# Altium project Controller.PrjPcb
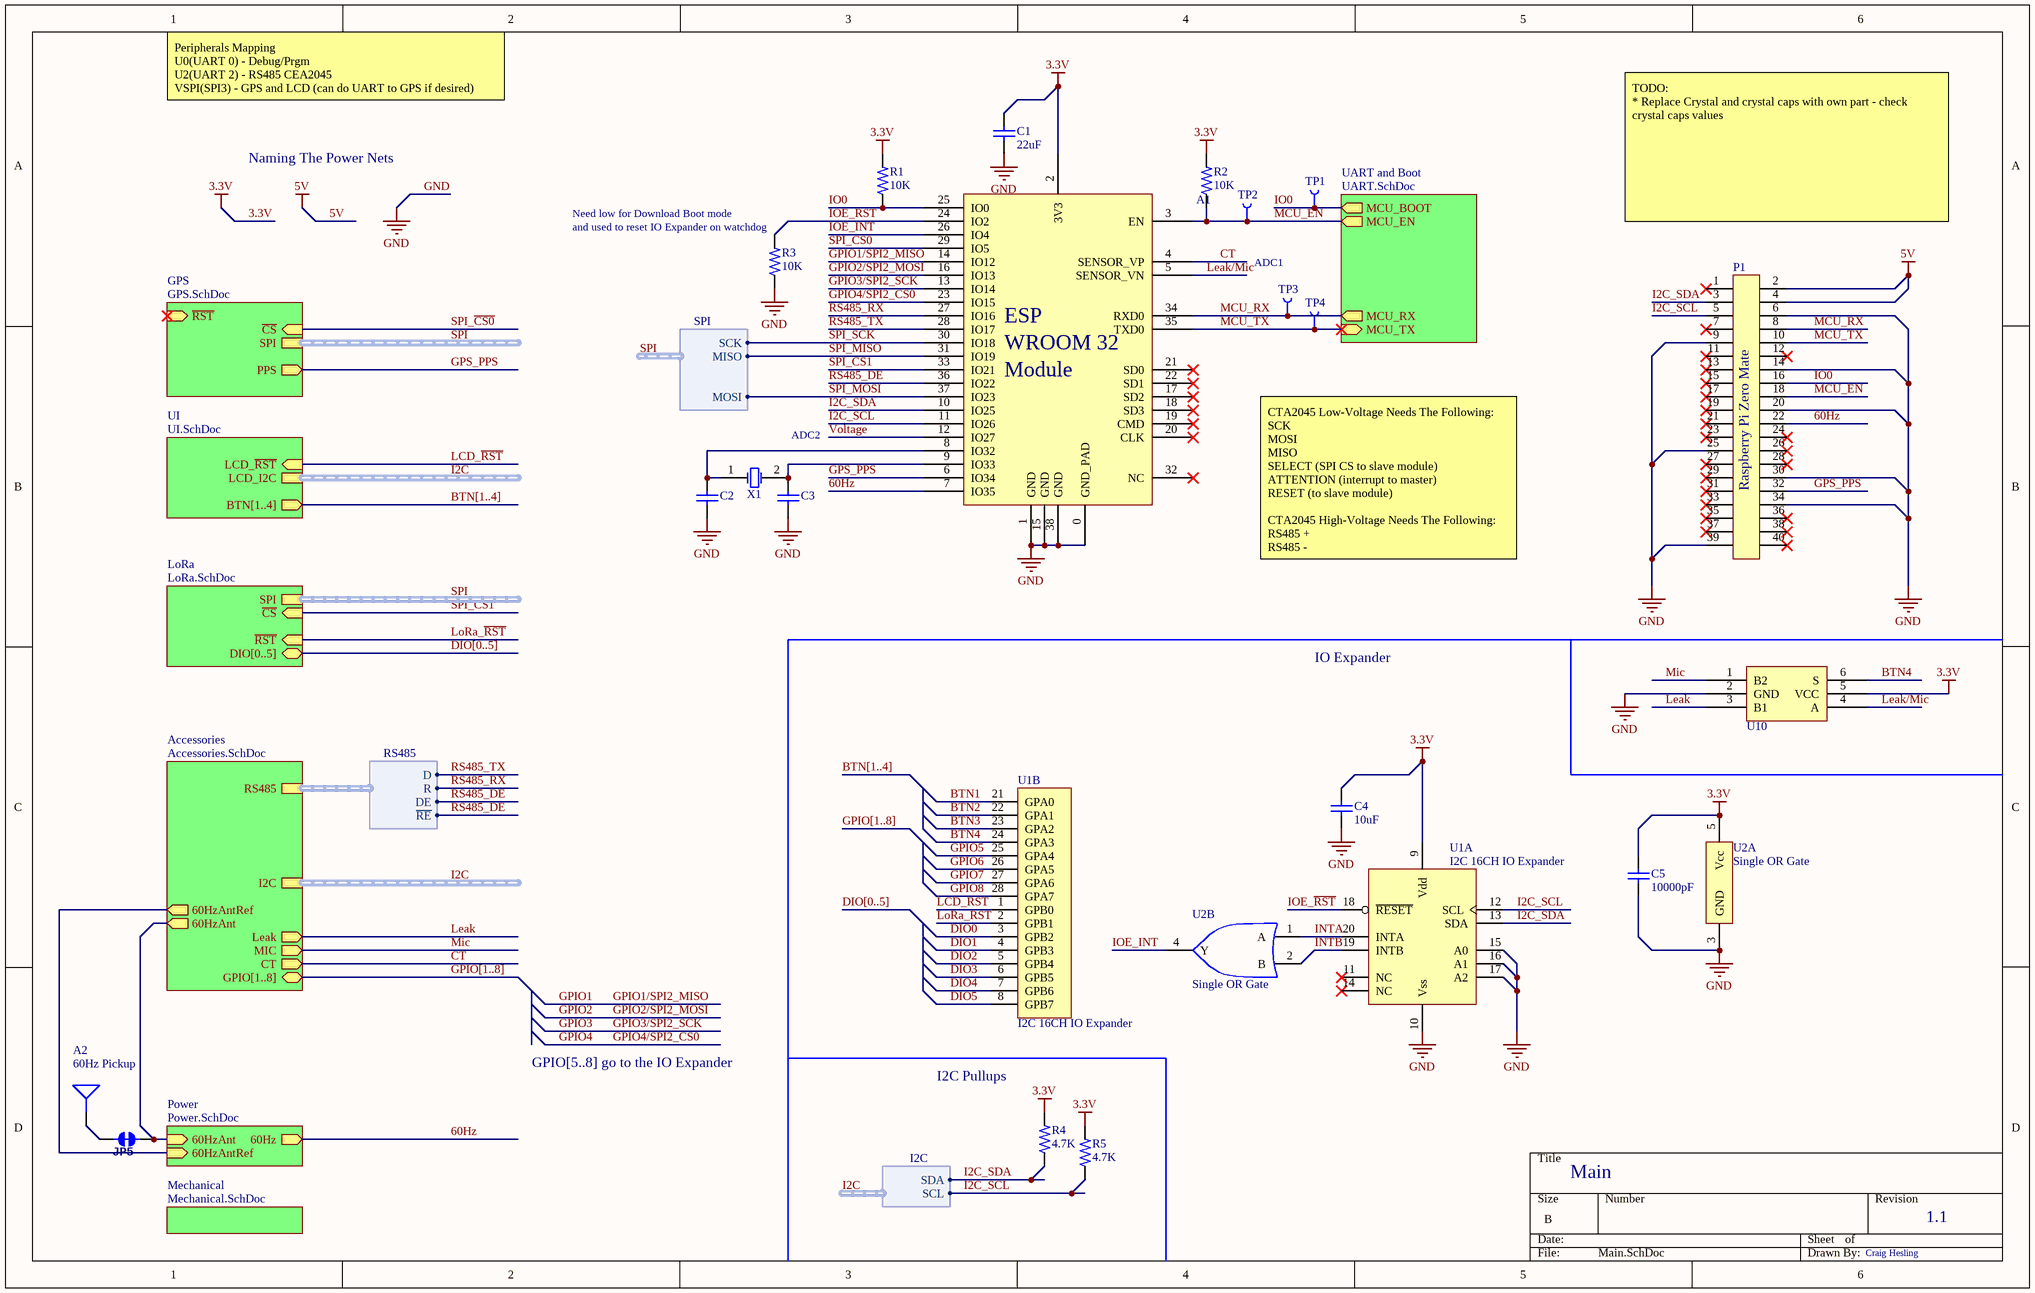
[diagram p0: Main.SchDoc]
8 sheets, 137 parts. Net scope: hierarchical (ports join the sheet entries above them; power ports are global).
Board files: PCBv1.PcbDoc, PCBv1.1.PcbDoc, PCBv1.2.PcbDoc, PCBv1.3.PcbDoc
Sheets:
  Main.SchDoc
    GPS = GPS.SchDoc
    UART and Boot = UART.SchDoc
    Power = Power.SchDoc
    Accessories = Accessories.SchDoc
    UI = UI.SchDoc
    LoRa = LoRa.SchDoc
    Mechanical = Mechanical.SchDoc

## Sheet Main.SchDoc: Main
size B; Author: Craig Hesling; DrawnBy: Craig Hesling; Revision: 1.1; SheetNumber: 1; SheetTotal: 7

### Parts
A1  ESP-WROOM-32  [ESP-WROOM-32]  (value not drawn)
A2  60Hz Pickup  [60HzPickup]
C1  22uF  [CAPC2013X14L - CAP0805 1.45mm Tall]
C2  CAP 12pF 16V 0603(1608)  [CAPC0603(1608)100_M]  (value not drawn)
C3  CAP 12pF 16V 0603(1608)  [CAPC0603(1608)100_M]  (value not drawn)
C4  10uF  [CAPC2013X14L - CAP0805 1.45mm Tall]
C5  10000pF  [CAPC1608X09L - CAP0603]
JP5  JUMPER-PAD-2-NC_BY_TRACENO_SILK  [PAD-JUMPER-2-NC_BY_TRACE_NO_SILK]  (value not drawn)
P1  Raspbery Pi Zero Mate  [Raspberry Pi Zero]  (value not drawn)
R1  10K  [RESC1608X06L - RES0603]
R2  10K  [RESC1608X06L - RES0603]
R3  10K  [RESC1608X06L - RES0603]
R4  4.7K  [RESC1608X06L - RES0603]
R5  4.7K  [RESC1608X06L - RES0603]
TP1  Test Point  [TestPoint1]  (value not drawn)
TP2  Test Point  [TestPoint1]  (value not drawn)
TP3  Test Point  [TestPoint1]  (value not drawn)
TP4  Test Point  [TestPoint1]  (value not drawn)
U1  I2C 16CH IO Expander  [SOIC127P1030X265-28L]  (parts A,B of 2)
U2  Single OR Gate  [SOT95P280X140-5L]  (parts A,B of 2)
U10  SN74LVC1G3157DCKR  [SC-70-6  (SOT-363)]  (value not drawn)
X1  14340272-32.768KHz  [ITTI-14340272-32.768KHz-2_V]  (value not drawn)

### Sub-sheets
Accessories = Accessories.SchDoc: Leak (out), MIC (out), CT (out), I2C (harness I2C), GPIO[1..8] (bidir), RS485 (harness RS485), 60HzAnt (out), 60HzAntRef (out)
GPS = GPS.SchDoc: SPI (harness SPI), ~{CS} (in), PPS (out), ~{RST} (in)
LoRa = LoRa.SchDoc: DIO[0..5] (bidir), SPI (harness SPI), ~{CS} (in), ~{RST} (in)
Mechanical = Mechanical.SchDoc: no entries
Power = Power.SchDoc: 60Hz (out), 60HzAnt (in), 60HzAntRef (in)
UART and Boot = UART.SchDoc: MCU_EN (out), MCU_BOOT (out), MCU_RX (out), MCU_TX (in)
UI = UI.SchDoc: BTN[1..4] (out), LCD_~{RST} (in), LCD_I2C (harness I2C)

### Harnesses
SPI: MISO, MOSI, SCK
RS485: R, ~{RE}, DE, D
I2C: SDA, SCL

### Nets
3.3V: A1.2(3V3) C1.2 C4.2 C5.2 R1.2 R2.2 R4.2 R5.2 U1.9(Vdd) U2.5(Vcc) U10.5(VCC)
5V: P1.2 P1.4
GND: A1.0(GND_PAD) A1.1(GND) A1.15(GND) A1.38(GND) C1.1 C2.1 C3.1 C4.1 C5.1 P1.6 P1.9 P1.14 P1.20 P1.25 P1.30 P1.34 P1.39 R3.1 U1.10(Vss) U1.15(A0) U1.16(A1) U1.17(A2) U2.3(GND) U10.2(GND)
60Hz: A1.7(IO35) P1.22 ; sheet Power/60Hz
60HzAnt: JP5.2 ; sheet Power/60HzAnt, sheet Accessories/60HzAnt
60HzAntRef: sheet Power/60HzAntRef, sheet Accessories/60HzAntRef
BTN1: U1.21(GPA0)
BTN2: U1.22(GPA1)
BTN3: U1.23(GPA2)
BTN4: U1.24(GPA3) U10.6(S)
CT: A1.4(SENSOR_VP) ; sheet Accessories/CT
DIO0: U1.3(GPB2)
DIO1: U1.4(GPB3)
DIO2: U1.5(GPB4)
DIO3: U1.6(GPB5)
DIO4: U1.7(GPB6)
DIO5: U1.8(GPB7)
GPIO1: A1.14(IO12)  [also labelled GPIO1/SPI2_MISO]
GPIO2: A1.16(IO13)  [also labelled GPIO2/SPI2_MOSI]
GPIO3: A1.13(IO14)  [also labelled GPIO3/SPI2_SCK]
GPIO4: A1.23(IO15)  [also labelled GPIO4/SPI2_~{CS0}]
GPIO5: U1.25(GPA4)
GPIO6: U1.26(GPA5)
GPIO7: U1.27(GPA6)
GPIO8: U1.28(GPA7)
GPS_PPS: A1.6(IO34) P1.32 ; sheet GPS/PPS
I2C_SCL: A1.11(IO26) P1.5 R5.1 U1.12(SCL) ; sheet Accessories/I2C.SCL  [project net I2C.SCL]
I2C_SDA: A1.10(IO25) P1.3 R4.1 U1.13(SDA) ; sheet Accessories/I2C.SDA  [project net I2C.SDA]
INTA: U1.20(INTA) U2.1(A)
INTB: U1.19(INTB) U2.2(B)
IO0: A1.25(IO0) P1.16 R1.1 TP1.1(P1) ; sheet UART and Boot/MCU_BOOT
IOE_INT: A1.26(IO4) U2.4(Y)
IOE_~{RST}: A1.24(IO2) R3.2 U1.18(~{RESET})
LCD_~{RST}: U1.1(GPB0) ; sheet UI/LCD_~{RST}
Leak: U10.3(B1) ; sheet Accessories/Leak
Leak/Mic: A1.5(SENSOR_VN) U10.4(A)
LoRa_~{RST}: U1.2(GPB1) ; sheet LoRa/~{RST}
MCU_EN: A1.3(EN) P1.18 R2.1 TP2.1(P1) ; sheet UART and Boot/MCU_EN
MCU_RX: A1.34(RXD0) P1.8 TP3.1(P1) ; sheet UART and Boot/MCU_RX
MCU_TX: A1.35(TXD0) P1.10 TP4.1(P1) ; sheet UART and Boot/MCU_TX
Mic: U10.1(B2) ; sheet Accessories/MIC
RS485_DE: A1.36(IO22) ; sheet Accessories/RS485.~{RE}, sheet Accessories/RS485.DE  [project net RS485.DE]
RS485_RX: A1.27(IO16) ; sheet Accessories/RS485.R  [project net RS485.R]
RS485_TX: A1.28(IO17) ; sheet Accessories/RS485.D  [project net RS485.D]
SPI_~{CS0}: A1.29(IO5) ; sheet GPS/~{CS}
SPI_~{CS1}: A1.33(IO21) ; sheet LoRa/~{CS}
SPI_MISO: A1.31(IO19) ; sheet GPS/SPI.MISO  [project net SPI.MISO]
SPI_MOSI: A1.37(IO23) ; sheet GPS/SPI.MOSI  [project net SPI.MOSI]
SPI_SCK: A1.30(IO18) ; sheet GPS/SPI.SCK  [project net SPI.SCK]
Voltage: A1.12(IO27)
NetA1_8: A1.8(IO32) C2.2 X1.1(X1)
NetA1_9: A1.9(IO33) C3.2 X1.2(X2)
NetA2_1: A2.1(Ant) JP5.1

Not connected (* = marked no-connect by the designer): A1 17(SD2)* 18(SD3)* 19(CMD)* 20(CLK)* 21(SD0)* 22(SD1)* 32(NC)*; P1 1* 7* 11* 12* 13* 15* 17* 19* 21* 23* 24* 26* 27* 28* 29* 31* 33* 35* 36* 37* 38* 40*; U1 11(NC)* 14(NC)*

### Buses and harness runs
bus BTN[1..4]
bus BTN[1..4] = sheet UI/BTN[1..4]
bus DIO[0..5]
bus DIO[0..5] = sheet LoRa/DIO[0..5]
bus GPIO[1..8]
bus GPIO[1..8] = sheet Accessories/GPIO[1..8]
harness I2C = sheet Accessories/I2C
harness I2C = sheet UI/LCD_I2C
harness SPI = sheet GPS/SPI
harness SPI = sheet LoRa/SPI

### Notes on the sheet
- Peripherals Mapping
  U0(UART 0) - Debug/Prgm
  U2(UART 2) - RS485 CEA2045
  VSPI(SPI3) - GPS and LCD (can do UART to GPS if desired)
  HSPI/HS2(Host SD 2) - SD Card
- Naming The Power Nets
- (near R3) Need low for Download Boot mode
- (near R3) and used to reset IO Expander on watchdog
- TODO:
  * Replace Crystal and crystal caps with own part - check crystal caps values
- ADC1
- ADC2
- CTA2045 Low-Voltage Needs The Following:
  SCK
  MOSI
  MISO
  SELECT (SPI CS to slave module)
  ATTENTION (interrupt to master)
  RESET (to slave module)
  CTA2045 High-Voltage Needs The Following:
  RS485 +
  RS485 -
- IO Expander
- GPIO[5..8] go to the IO Expander
- I2C Pullups
- (in symbol ESP-WROOM-32) ESP; WROOM 32; Module

### Library data of the parts
A1 = ESP-WROOM-32: ESP WROOM 32 Module; Supplier 1: Digi-Key; Supplier Part Number 1: 1528-1801-ND
A2 = 60Hz pickup with via: 5cm 60Hz pickup antenna with via for external wire
C1 = CAP0805 22uF 10% 6.3V X5R: SMT 0805 Ceramic Capacitor; TempCoeff: X5R; Tolerance: 10%; Voltage: 6.3V; Value: 22uF; Supplier 1: Digi-Key; Supplier Part Number 1: 1276-6687-1-ND; Supplier 2: Digi-Key; Supplier Part Number 2: 311-1860-1-ND
C2 C3 = CMP-1035-00607-1: CAP 12pF 16V ±10% 0603 (1608 Metric) Thickness 1mm SMD; Case-Metric: 1608; Tolerance: Â±10%; Case-EIA: 0603; Value: 12pF; Max Thickness: 1 mm; Technology: SMT; Rated Voltage: 16 V
C4 = CAP0805 10uF 10% 6.3V X5R: SMT 0805 Ceramic Capacitor; TempCoeff: X5R; Tolerance: 10%; Voltage: 6.3V; Value: 10uF; Supplier 1: Digi-Key; Supplier Part Number 1: 1276-6457-1-ND
C5 = CAP0603 10000pF 10% 50V X7R: SMT 0603 Ceramic Capacitor; TempCoeff: X7R; Tolerance: 10%; Voltage: 50V; Value: 10000pF; Supplier 1: Digi-Key; Supplier 2: Digi-Key; Supplier 3: Digi-Key; Supplier Part Number 1: 478-1215-1-ND; Supplier Part Number 2: 311-1080-1-ND; Supplier Part Number 3: 490-1494-1-ND
P1 = Raspberry Pi Zero Mate: The header and mechanical drawings for connnecting a Raspbery Pi Zero
R1-R3 = RES0603 10K 1% 1/10W: SMT 0603 Ceramic Resistor; Power: 1/10W; Tolerance: 1%; Supplier 1: Digi-Key; Supplier 2: Digi-Key; Supplier 3: Digi-Key; Supplier Part Number 1: 311-10.0KHRCT-ND; Supplier Part Number 2: RMCF0603FT10K0CT-ND; Supplier Part Number 3: P10.0KHCT-ND; Value: 10K
R4 R5 = RES0603 4.7K 1% 1/10W: SMT 0603 Ceramic Resistor; Power: 1/10W; Tolerance: 1%; Value: 4.7K; Supplier 1: Digi-Key; Supplier 2: Digi-Key; Supplier 3: Digi-Key; Supplier Part Number 1: 311-4.70KHRCT-ND; Supplier Part Number 2: P4.70KHCT-ND; Supplier Part Number 3: RMCF0603FT4K70CT-ND
TP1-TP4 = TestPoint1: Small 0.762mm Round Test Point
U1 = MCP23017T-E/SO: Microchip MCP23017 I2C 16CH IO Expander; Supplier 1: Digi-Key; Supplier Part Number 1: MCP23017T-E/SOCT-ND
U2 = NC7S32M5X: Fairchild/ON Semi NC7S32M5X Single OR Gate; Supplier 1: Digi-Key; Supplier Part Number 1: NC7S32M5XCT-ND
U10 = SN74LVC1G3157DCKR: IC, SWITCH, SPDT ANA, SMD; Manufacturer: Texas Instruments; Min Supply Voltage: 1.65V; Max Supply Voltage: 5.5V; Number of Channels: 1; Bandwidth: 300MHz; Number of Outputs: 2; Nominal Supply Current: 10uA; On-State Resistance: 15R; Operating Supply Current: 1uA; Turn-On Delay Time: 5.7ns; Turn-Off Delay Time: 3.8ns; Supply Type: Single; Propagation Delay: 300ps; Polarity: Non-Inverting; Low Level Output Current: 128mA; Supplier 1: Avnet; Manufacturer Part Number: SN74LVC1G3157DCKR; Stock 1: 76000; Pricing 1: 1=0.29612, 30=0.2755, 75=0.21727, 150=0.1881, 375=0.15656, 3000=0.07742, 6000=0.07106, 12000=0.07058, 18000=0.07011, 30000=0.05947 (USD); Mount: Surface Mount; Case/Package: SC; Number of Pins: 6; Weight: 8.8E-05oz; Contact Plating: Gold; Min Operating Temperature: -40°C; Max Operating Temperature: 125°C; Packaging: Tape and Reel; Number of Inputs: 1; Package Quantity: 3000; Max Supply Current: 10uA; Termination: SMD/SMT; Throw Configuration: SPDT; Number of Bits: 1; High Level Output Current: 128mA; Length: 2mm; Height: 0.9mm; Width: 1.25mm; Radiation Hardening: No; REACH SVHC: No SVHC; Lead Free: Lead Free; ComponentLink1URL: https://datasheet.ciiva.com/1669/sn74lvc1g3157-1669380.pdf; ComponentLink1Description: https://datasheet.ciiva.com/1669/sn74lvc1g3157-1669380.pdf; ComponentLink2URL: https://datasheet.ciiva.com/1514/1857156-1514549.pdf; ComponentLink2Description: https://datasheet.ciiva.com/1514/1857156-1514549.pdf; ComponentLink3URL: https://datasheet.ciiva.com/1669/sn74lvc1g3157-1669381.pdf; ComponentLink3Description: https://datasheet.ciiva.com/1669/sn74lvc1g3157-1669381.pdf; ComponentLink4URL: https://datasheet.ciiva.com/14435/sn74lvc1g3157-14435733.pdf; ComponentLink4Description: https://datasheet.ciiva.com/14435/sn74lvc1g3157-14435733.pdf; ComponentLink5URL: https://datasheet.ciiva.com/34301/756764-34301477.pdf; ComponentLink5Description: https://datasheet.ciiva.com/34301/756764-34301477.pdf; ComponentLink6URL: https://datasheet.ciiva.com/1514/1857156-1514550.pdf; ComponentLink6Description: https://datasheet.ciiva.com/1514/1857156-1514550.pdf; ComponentLink7URL: https://datasheet.ciiva.com/1669/sn74lvc1g3157-1669382.pdf; ComponentLink7Description: https://datasheet.ciiva.com/1669/sn74lvc1g3157-1669382.pdf; ComponentLink8URL: https://datasheet.ciiva.com/46411/1786793-46411528.pdf; ComponentLink8Description: https://datasheet.ciiva.com/46411/1786793-46411528.pdf; ComponentLink9URL: https://datasheet.ciiva.com/16539/sn74lvc1g3157-16539371.pdf; ComponentLink9Description: https://datasheet.ciiva.com/16539/sn74lvc1g3157-16539371.pdf; ComponentLink10URL: https://datasheet.ciiva.com/15127/getdatasheetpartid-187022-15127388.pdf; ComponentLink10Description: https://datasheet.ciiva.com/15127/getdatasheetpartid-187022-15127388.pdf; ComponentLink11URL: https://datasheet.ciiva.com/41461/001187224-da-01-en-ic-switch-sn74lvc1g3157dckr-sc-70-6-tid-41461882.pdf; ComponentLink11Description: https://datasheet.ciiva.com/41461/001187224-da-01-en-ic-switch-sn74lvc1g3157dckr-sc-70-6-tid-41461882.pdf; Supplier Part Number 1: SN74LVC1G3157DCKR/BKN
X1 = CMP-0463-00001-2: Crystal, 32.768 KHz, -40 to 85 degC, 3.2 x 1.5 x 0.9 mm SMD; Manufacturer: ITTI; Load Capacitance: 12.5 pF; Frequency Tolerance: +/-20 ppm; Drive Level: 1 max. uw; Nominal Frequency: 32.768KHz; Mounting Technology: Surface Mount; Operating temperature: -40 to 85 degC; PartNumber: 14340272-32.768KHz; ComponentLink1URL: http://www.itti-co.com; ComponentLink1Description: Manufacturer URL; PackageReference: 14340272-32.768KHz-2; PackageDescription: 2-Pin Hand Drawn, Body 3.2 x 1.5mm, Pitch 2.5 mm

## Sheet GPS.SchDoc: GPS
size A; Author: Craig Hesling; DrawnBy: Craig Hesling; Revision: 1
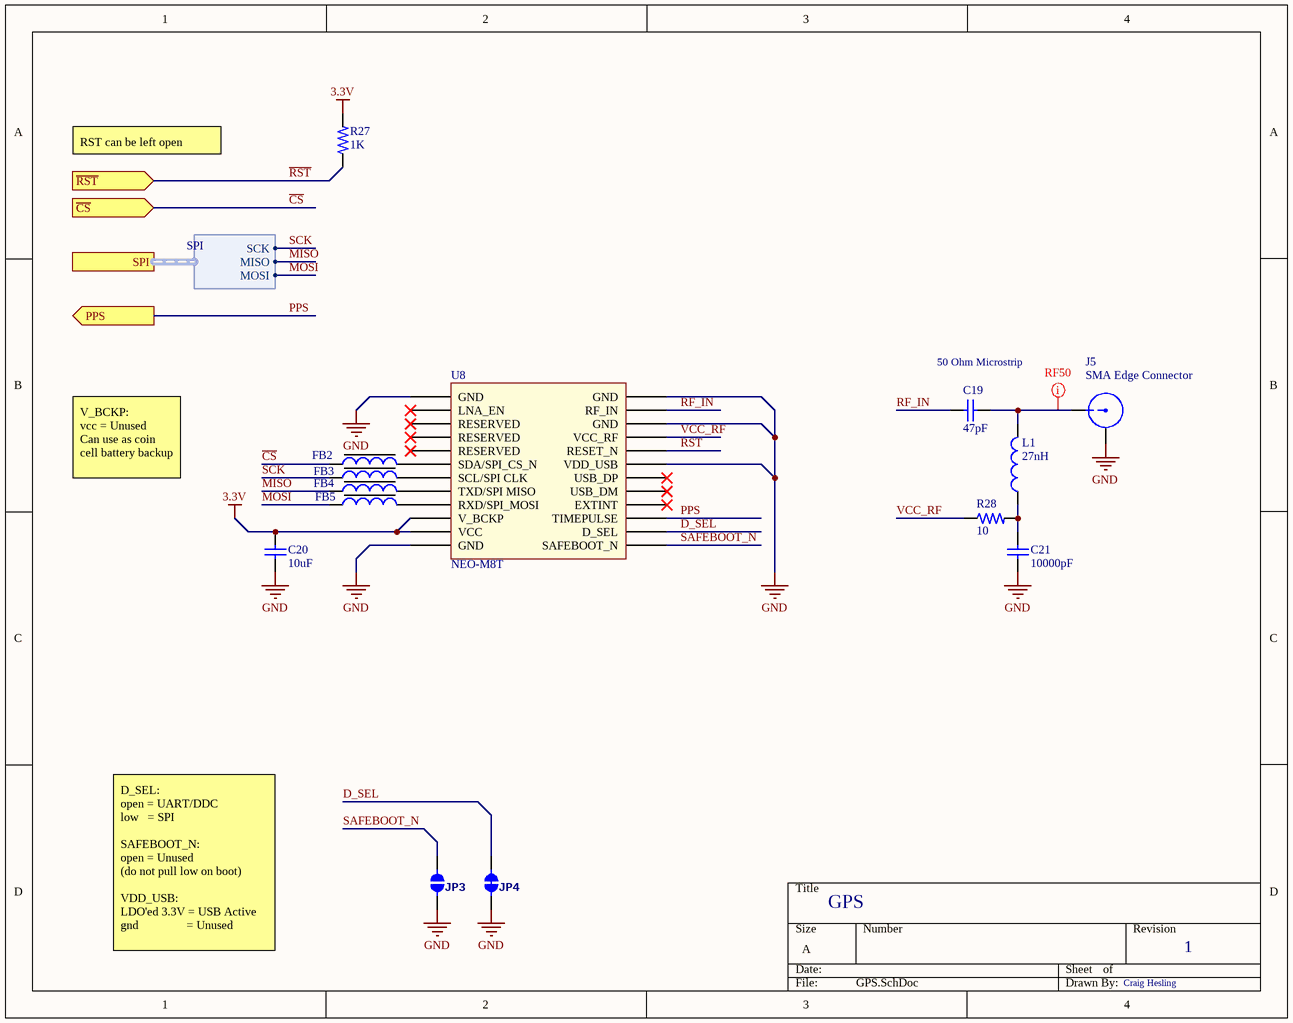
[diagram p1: GPS.SchDoc]

### Parts
C19  47pF  [CAPC1608X09L - CAP0603]
C20  10uF  [CAPC2013X14L - CAP0805 1.45mm Tall]
C21  10000pF  [CAPC1608X09L - CAP0603]
FB2  Feritte Bead 1kOhm  [FB1608X09L]  (value not drawn)
FB3  Feritte Bead 1kOhm  [FB1608X09L]  (value not drawn)
FB4  Feritte Bead 1kOhm  [FB1608X09L]  (value not drawn)
FB5  Feritte Bead 1kOhm  [FB1608X09L]  (value not drawn)
J5  SMA Edge Connector  [SMA Connector - Edge Mount Short]
JP3  JUMPER-PAD-2-NO  [PAD-JUMPER-2-NO_NO_SILK]  (value not drawn)
JP4  JUMPER-PAD-2-NC_BY_TRACENO_SILK  [PAD-JUMPER-2-NC_BY_TRACE_NO_SILK]  (value not drawn)
L1  27nH  [INDC1608X09L - IND0603 0.95MM TALL]
R27  1K  [RESC1608X06L - RES0603]
R28  10  [RESC1608X06L - RES0603]
U8  NEO-M8T  [NEO]

### Ports
PPS (out), SPI (harness SPI), ~{CS} (in), ~{RST} (in)

### Harnesses
SPI: MISO, MOSI, SCK

### Nets
3.3V: C20.2 R27.2 U8.22(V_BCKP) U8.23(VCC)
GND: C20.1 C21.1 J5.2(GND) JP3.1 JP4.1 U8.7(VDD_USB) U8.10(GND) U8.12(GND) U8.13(GND) U8.24(GND)
~{CS}: FB2.1 ; port ~{CS}  [project net SPI_~{CS0}]
D_SEL: JP4.2 U8.2(D_SEL)
MISO: FB4.1 ; port SPI.MISO  [project net SPI.MISO]
MOSI: FB5.1 ; port SPI.MOSI  [project net SPI.MOSI]
PPS: U8.3(TIMEPULSE) ; port PPS  [project net GPS_PPS]
~{RST}: R27.1 U8.8(RESET_N) ; port ~{RST}
RF_IN: C19.1 U8.11(RF_IN)
SAFEBOOT_N: JP3.2 U8.1(SAFEBOOT_N)
SCK: FB3.1 ; port SPI.SCK  [project net SPI.SCK]
VCC_RF: R28.1 U8.9(VCC_RF)
NetC19_2: C19.2 J5.1(Signal) L1.2
NetC21_2: C21.2 L1.1 R28.2
NetFB2_2: FB2.2 U8.18(SDA/SPI_CS_N)
NetFB3_2: FB3.2 U8.19(SCL/SPI_CLK)
NetFB4_2: FB4.2 U8.20(TXD/SPI_MISO)
NetFB5_2: FB5.2 U8.21(RXD/SPI_MOSI)

Not connected (* = marked no-connect by the designer): U8 4(EXTINT)* 5(USB_DM)* 6(USB_DP)* 14(LNA_EN)* 15(RESERVED)* 16(RESERVED)* 17(RESERVED)*

### Layout directives
net class RF50: NetC19_2

### Notes on the sheet
- RST can be left open
- (near C19) 50 Ohm Microstrip
- V_BCKP:
  vcc = Unused
  Can use as coin cell battery backup
- D_SEL:
  open = UART/DDC
  low   = SPI
  SAFEBOOT_N:
  open = Unused
  (do not pull low on boot)
  VDD_USB:
  LDO'ed 3.3V = USB Active
  gnd                = Unused

### Library data of the parts
C19 = CAP0603 47pF 5% 50V NP0: SMT 0603 Ceramic Capacitor; TempCoeff: NP0; Tolerance: 5%; Voltage: 50V; Value: 47pF; Supplier 1: Digi-Key; Supplier 2: Digi-Key; Supplier 3: Arrow; Supplier 4: Digi-Key; Supplier Part Number 1: 1276-1037-1-ND; Supplier Part Number 2: 1276-2296-1-ND; Supplier Part Number 3: CFabNzdY6X6BB7Ej2OVMNUmEE8oTDHVGVspzp79aHa0; Supplier Part Number 4: 399-1056-1-ND
C20 = CAP0805 10uF 10% 6.3V X5R: as C4 on sheet Main; Value: 10uF; Supplier 1: Digi-Key; Supplier Part Number 1: 1276-6457-1-ND
C21 = CAP0603 10000pF 10% 50V X7R: as C5 on sheet Main; Value: 10000pF; Supplier 1: Digi-Key; Supplier 2: Digi-Key; Supplier 3: Digi-Key; Supplier Part Number 1: 478-1215-1-ND; Supplier Part Number 2: 311-1080-1-ND; Supplier Part Number 3: 490-1494-1-ND
FB2-FB5 = FB0603 1kOhm: Impedance at 100MHz: 1kOhms; Supplier 1: Digi-Key; Supplier Part Number 1: 490-1015-1-ND
L1 = IND0603 27nH 400mA 5% 650mOhm 1.7GHz: SMT 0603 Ceramic Inductor; Tolerance: 5%; Current Rating: 300mA; DC Resistance: 450mOhm; Self Resonant: 1.7GHz; Value: 27nH; Supplier 1: Digi-Key; Supplier Part Number 1: 732-6268-1-ND
R27 = RES0603 1K 1% 1/10W: SMT 0603 Ceramic Resistor; Power: 1/10W; Tolerance: 1%; Value: 1K; Supplier 1: Digi-Key; Supplier 2: Digi-Key; Supplier 3: Digi-Key; Supplier Part Number 1: 311-1.00KHRCT-ND; Supplier Part Number 2: P1.00KHCT-ND; Supplier Part Number 3: RMCF0603FG1K00CT-ND
R28 = RES0603 10 1% 1/10W: SMT 0603 Ceramic Resistor; Power: 1/10W; Tolerance: 1%; Value: 10; Supplier 1: Digi-Key; Supplier 2: Digi-Key; Supplier 3: Digi-Key; Supplier Part Number 1: 311-10.0HRCT-ND; Supplier Part Number 2: RMCF0603FT10R0CT-ND; Supplier Part Number 3: CR0603-FX-10R0ELFCT-ND
U8 = NEO: u-blox NEO GNSS module; Part Description: u-blox GNSS module; Value: NEO-M8; Manufacturer: u-blox
J5 = SMA Edge Connector: Supplier 1: Digi-Key; Supplier 2: Digi-Key; Supplier 3: Digi-Key; Supplier Part Number 1: CON-SMA-EDGE-S-ND; Supplier Part Number 2: 931-1174-ND; Supplier Part Number 3: 931-1175-ND

## Sheet UART.SchDoc: UART
size A; DrawnBy: Craig Hesling; Revision: 2
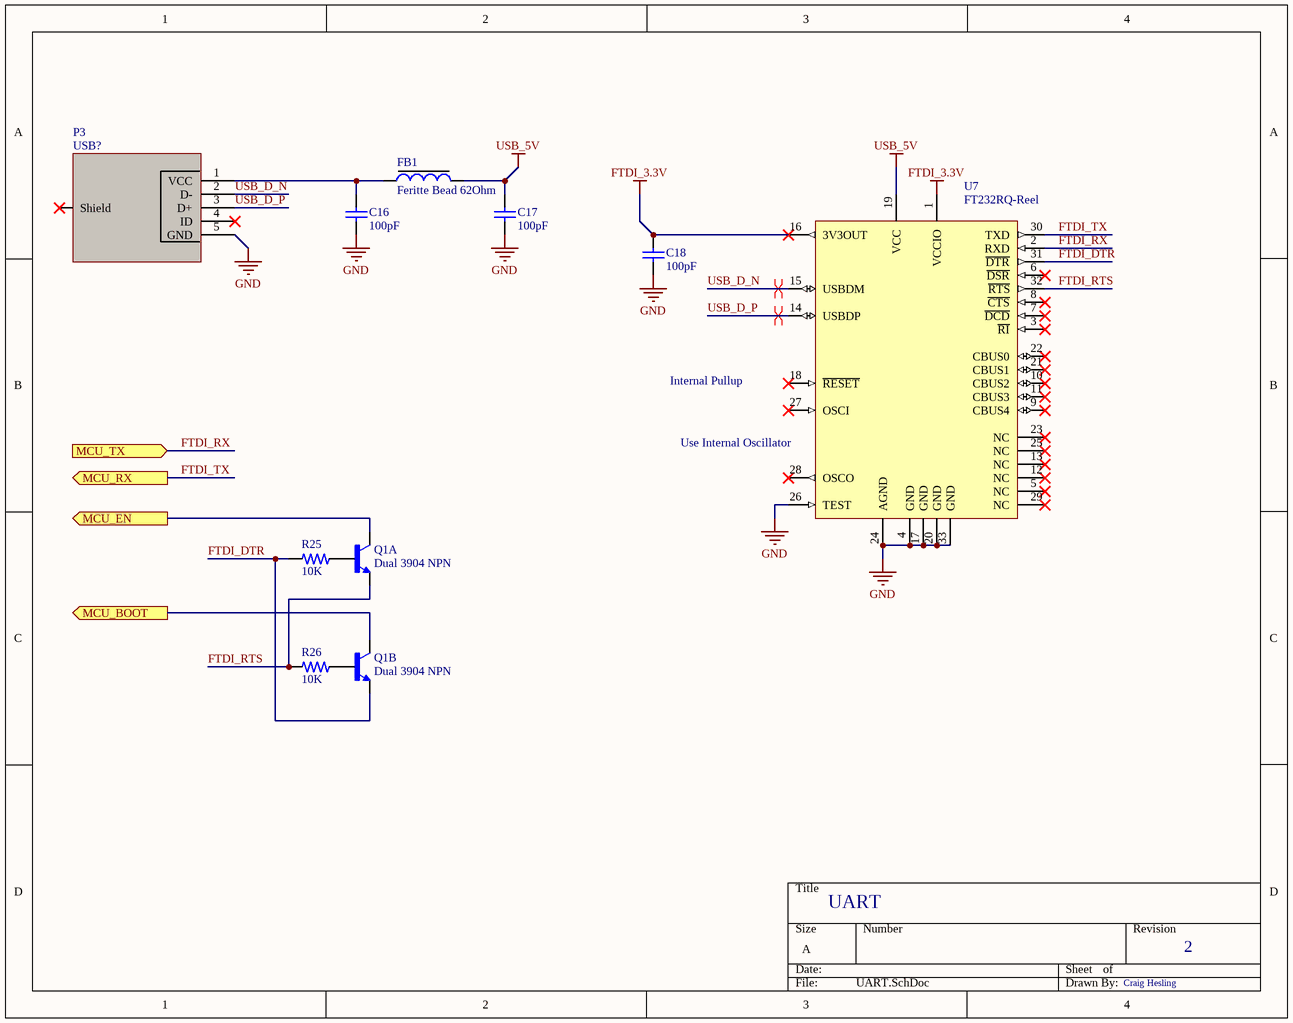
[diagram p2: UART.SchDoc]

### Parts
C16  100pF  [CAPC1608X09L - CAP0603]
C17  100pF  [CAPC1608X09L - CAP0603]
C18  100pF  [CAPC1608X09L - CAP0603]
FB1  Feritte Bead 62Ohm  [INDC1608X10L - FL0603]
P3  USB?  [MicroUSB_TypeB]
Q1  Dual 3904 NPN  [SOT65P210X110-6L]  (parts A,B of 2)
R25  10K  [RESC1608X06L - RES0603]
R26  10K  [RESC1608X06L - RES0603]
U7  FT232RQ-Reel  [PQFN5X5-32_V_FTDI_BIG_VIAS_LEADS]

### Ports
MCU_BOOT (out), MCU_EN (out), MCU_RX (out), MCU_TX (in)

### Nets
FTDI_3.3V: C18.2 U7.1(VCCIO) U7.16(3V3OUT)
GND: C16.1 C17.1 C18.1 P3.5(GND) U7.4(GND) U7.17(GND) U7.20(GND) U7.24(AGND) U7.26(TEST) U7.33(GND)
USB_5V: C17.2 FB1.2 U7.19(VCC)
FTDI_DTR: Q1.1(E2) R25.2 U7.31(~{DTR})
FTDI_RTS: Q1.4(E1) R26.2 U7.32(~{RTS})
FTDI_RX: U7.2(RXD) ; port MCU_TX  [project net MCU_TX]
FTDI_TX: U7.30(TXD) ; port MCU_RX  [project net MCU_RX]
IO0: Q1.6(C2) ; port MCU_BOOT
MCU_EN: Q1.3(C1) ; port MCU_EN
USB_D_N: P3.2(D-) U7.15(USBDM)
USB_D_P: P3.3(D+) U7.14(USBDP)
NetC16_2: C16.2 FB1.1 P3.1(VCC)
NetQ1_2: Q1.2(B2) R26.1
NetQ1_5: Q1.5(B1) R25.1

Not connected (* = marked no-connect by the designer): P3 0(Shield)* 4(ID)*; U7 3(~{RI})* 5(NC)* 6(~{DSR})* 7(~{DCD})* 8(~{CTS})* 9(CBUS4)* 10(CBUS2)* 11(CBUS3)* 12(NC)* 13(NC)* 18(~{RESET})* 21(CBUS1)* 22(CBUS0)* 23(NC)* 25(NC)* 27(OSCI)* 28(OSCO)* 29(NC)*

### Layout directives
differential pair: USB_D_N, USB_D_P

### Notes on the sheet
- Internal Pullup
- (near U7) Use Internal Oscillator

### Library data of the parts
C16-C18 = CAP0603 100pF 5% 50V NP0: SMT 0603 Ceramic Capacitor; TempCoeff: NP0; Tolerance: 5%; Voltage: 50V; Value: 100pF; Supplier 1: Digi-Key; Supplier 2: Digi-Key; Supplier Part Number 1: 399-1061-1-ND; Supplier Part Number 2: 490-1427-1-ND
FB1 = FB0603 62Ohm: Impedance at 100MHz: 62Ohms; Supplier 1: Digi-Key; Supplier Part Number 1: 732-6702-1-ND
P3 = MicroUSB TypeB: Micro USB Type B Port; Supplier: http://www.digikey.com/product-detail/en/amphenol-fci/10118192-0001LF/609-4613-2-ND/2785387; Datasheet: http://portal.fciconnect.com/Comergent//fci/drawing/10118192.pdf; Supplier 1: Digi-Key; Supplier Part Number 1: 609-4613-1-ND
Q1 = MBT3904DW1T1G: 3904 Dual NPN Transistor; Supplier 1: Digi-Key; Supplier 2: Mouser; Supplier Part Number 1: MBT3904DW1T1GOSCT-ND; Supplier Part Number 2: 863-SMBT3904DW1T1G
R25 R26 = RES0603 10K 1% 1/10W: as R1 on sheet Main; Supplier 1: Digi-Key; Supplier 2: Digi-Key; Supplier 3: Digi-Key; Supplier Part Number 1: 311-10.0KHRCT-ND; Supplier Part Number 2: RMCF0603FT10K0CT-ND; Supplier Part Number 3: P10.0KHCT-ND; Value: 10K
U7 = FT232RQ-Reel: USB UART Asynchronous Serial Data Transfer Chip, 32-pin QFN, Tape and Reel; Manufacturer: FTDI; DatasheetVersion: ver 2.10, Mar-2012; PackageVersion: Mar-12; PackageReference: PQFN5X5-32; PackageDescription: 32-Pin Quad Flat No-Lead 0.5 mm Pitch, Pullback, 3.2 x 3.2 mm Exposed Pad; PartNumber: FT232RQ-Reel; ComponentLink1Description: Manufacturer URL; ComponentLink1URL: http://www.ftdichip.com/; ComponentLink2Description: Datasheet; ComponentLink2URL: http://www.ftdichip.com/Support/Documents/DataSheets/ICs/DS_FT232R.pdf

## Sheet Power.SchDoc: Power
size A; Author: Craig Hesling; DrawnBy: Craig Hesling; Revision: 1.1
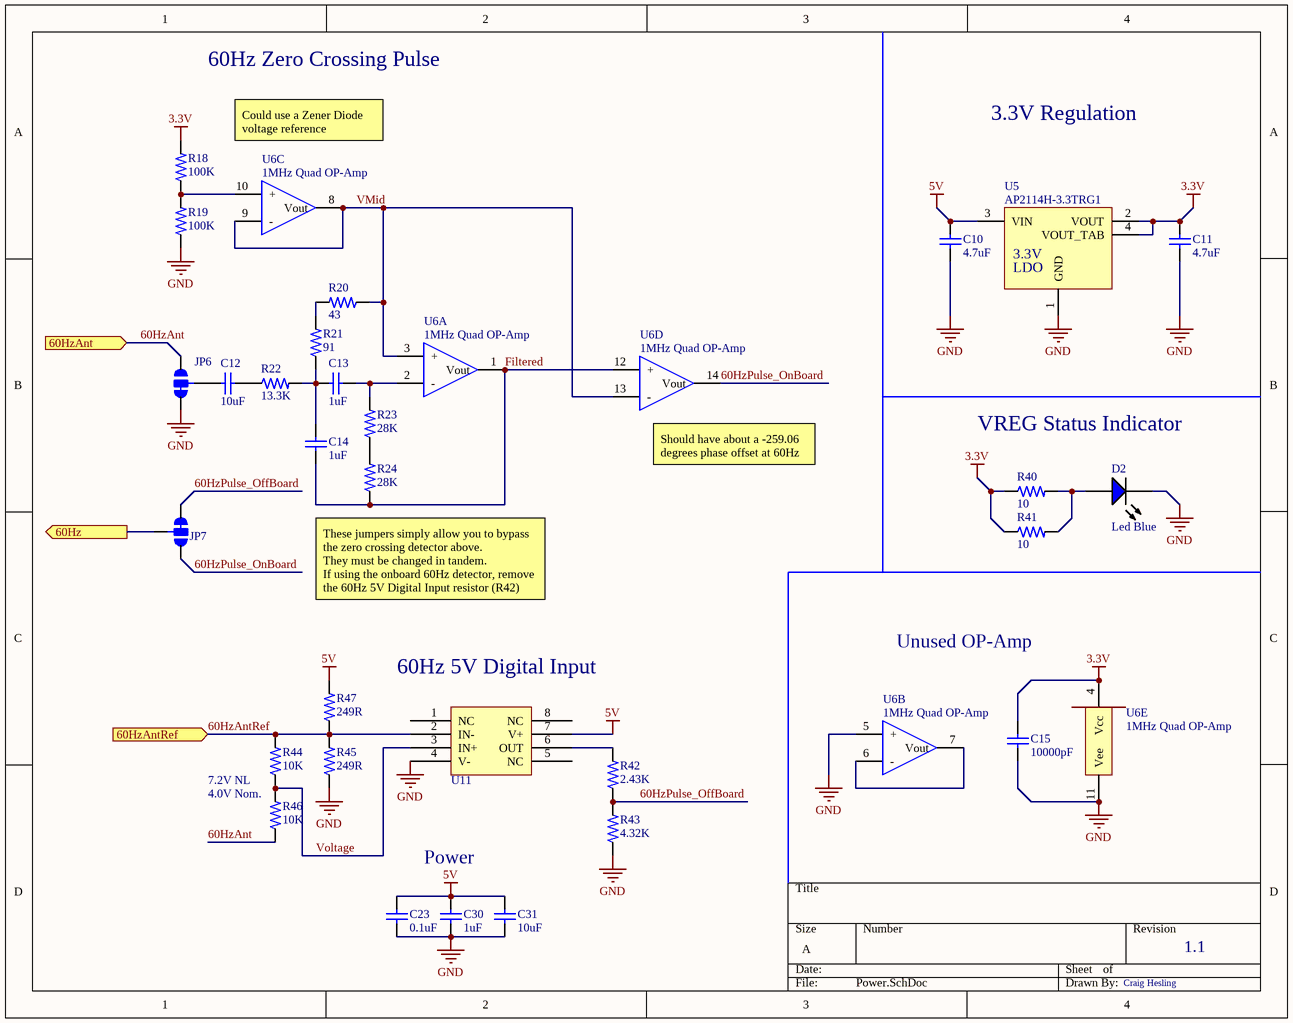
[diagram p3: Power.SchDoc]

### Parts
C10  4.7uF  [CAPC3216X18L - CAP1206 1.8MM TALL]
C11  4.7uF  [CAPC3216X18L - CAP1206 1.8MM TALL]
C12  10uF  [CAPC1608X09L - CAP0603]
C13  1uF  [CAPC1608X09L - CAP0603]
C14  1uF  [CAPC1608X09L - CAP0603]
C15  10000pF  [CAPC1608X09L - CAP0603]
C23  0.1uF  [CAPC1608X09L - CAP0603]
C30  1uF  [CAPC1608X09L - CAP0603]
C31  10uF  [CAPC1608X09L - CAP0603]
D2  Led Blue  [LED-0603-BLUE .7MM TALL]
JP6  JUMPER-PAD-3-2OF3_NC_BY_TRACE_SMALL  [PAD-JUMPER-3-2OF3_NC_BY_TRACE_YES_SILK_FULL_BOX]  (value not drawn)
JP7  JUMPER-PAD-3-2OF3_NC_BY_TRACE_SMALL  [PAD-JUMPER-3-2OF3_NC_BY_TRACE_YES_SILK_FULL_BOX]  (value not drawn)
R18  100K  [RESC1608X06L - RES0603]
R19  100K  [RESC1608X06L - RES0603]
R20  43  [RESC1608X06L - RES0603]
R21  91  [RESC1608X06L - RES0603]
R22  13.3K  [RESC1608X06L - RES0603]
R23  28K  [RESC1608X06L - RES0603]
R24  28K  [RESC1608X06L - RES0603]
R40  10  [RESC1608X06L - RES0603]
R41  10  [RESC1608X06L - RES0603]
R42  2.43K  [RESC1608X06L - RES0603]
R43  4.32K  [RESC1608X06L - RES0603]
R44  10K  [RESC1608X06L - RES0603]
R45  249R  [RESC1608X06L - RES0603]
R46  10K  [RESC1608X06L - RES0603]
R47  249R  [RESC1608X06L - RES0603]
U5  AP2114H-3.3TRG1  [SOT230P700X180-4L]
U6  1MHz Quad OP-Amp  [SOIC127P600X175-14L]  (parts A,B,C,D,E of 5)
U11  LT1818IS8#PBF  [SOIC127P600X175-8N]  (value not drawn)

### Ports
60Hz (out), 60HzAnt (in), 60HzAntRef (in)

### Nets
3.3V: C11.2 C15.2 R18.2 R40.1 R41.1 U5.2(VOUT) U5.4(VOUT_TAB) U6.4(Vcc)
5V: C10.2 C23.2 C30.2 C31.2 R47.2 U5.3(VIN) U11.7(V+)
GND: C10.1 C11.1 C15.1 C23.1 C30.1 C31.1 D2.K JP6.3 R19.1 R43.1 R45.1 U5.1(GND) U6.5(+) U6.11(Vee) U11.4(V-)
60Hz: JP7.2 ; port 60Hz
60HzAnt: JP6.1 R46.1 ; port 60HzAnt
60HzAntRef: R44.2 R45.2 R47.1 U11.2(IN-) ; port 60HzAntRef
60HzPulse_OffBoard: JP7.3 R42.1 R43.2
60HzPulse_OnBoard: JP7.1 U6.14(Vout)
Filtered: C14.1 R24.1 U6.1(Vout) U6.12(+)
VMid: R20.1 U6.3(+) U6.8(Vout) U6.9(-) U6.13(-)
Voltage: R44.1 R46.2 U11.3(IN+)
NetC12_1: C12.1 R22.1
NetC12_2: C12.2 JP6.2
NetC13_1: C13.1 R23.2 U6.2(-)
NetC13_2: C13.2 C14.2 R21.1 R22.2
NetD2_A: D2.A R40.2 R41.2
NetR18_1: R18.1 R19.2 U6.10(+)
NetR20_2: R20.2 R21.2
NetR23_1: R23.1 R24.2
NetR42_2: R42.2 U11.6(OUT)
NetU6_6: U6.6(-) U6.7(Vout)

Not connected (* = marked no-connect by the designer): U11 1(NC) 5(NC) 8(NC)

### Notes on the sheet
- 60Hz Zero Crossing Pulse
- Could use a Zener Diode voltage reference
- 3.3V Regulation
- VREG Status Indicator
- (near U6) Should have about a -259.06 degrees phase offset at 60Hz
- (near R24) These jumpers simply allow you to bypass the zero crossing detector above.
  They must be changed in tandem.
  If using the onboard 60Hz detector, remove the 60Hz 5V Digital Input resistor (R42) also.
- (near U11) 60Hz 5V Digital Input
- Unused OP-Amp
- 7.2V NL
- 4.0V Nom.
- (in symbol AP2114H-3.3TRG1) 3.3V; LDO

### Library data of the parts
C10 C11 = CAP1206 4.7uF 10% 25V X5R: SMT 1206 Ceramic Capacitor; TempCoeff: X5R; Tolerance: 10%; Voltage: 25V; Value: 4.7uF; Supplier 1: Digi-Key; Supplier Part Number 1: 587-1336-1-ND
C12 C31 = CAP0603 10uF 20% 6.3V X5R: SMT 0603 Ceramic Capacitor; TempCoeff: X5R; Tolerance: 20%; Voltage: 6.3V; Value: 10uF; Supplier 1: Digi-Key; Supplier 2: Digi-Key; Supplier Part Number 1: 587-1256-1-ND; Supplier Part Number 2: 490-3896-1-ND
C13 C14 C30 = CAP0603 1uF 10% 10V X7R: SMT 0603 Ceramic Capacitor; TempCoeff: X7R; Tolerance: 10%; Voltage: 10V; Value: 1uF; Supplier 1: Digi-Key; Supplier Part Number 1: 1276-1946-1-ND; Supplier 2: Digi-Key; Supplier Part Number 2: 399-3118-1-ND
C15 = CAP0603 10000pF 10% 50V X7R: as C5 on sheet Main; Value: 10000pF; Supplier 1: Digi-Key; Supplier 2: Digi-Key; Supplier 3: Digi-Key; Supplier Part Number 1: 478-1215-1-ND; Supplier Part Number 2: 311-1080-1-ND; Supplier Part Number 3: 490-1494-1-ND
C23 = CAP0603 0.1uF 10% 25V X7R: SMT 0603 Ceramic Capacitor; TempCoeff: X7R; Tolerance: 10%; Voltage: 25V; Value: 0.1uF; Supplier 1: Digi-Key; Supplier 2: Digi-Key; Supplier Part Number 1: 311-1341-1-ND; Supplier Part Number 2: 490-1524-1-ND
D2 = LED0603 BLUE 20mA 250mcd: LED BLUE CLEAR 0603 SMD 145 mcd; Supplier 1: Digi-Key; Supplier Part Number 1: 732-4966-6-ND
R18 R19 = RES0603 100K 1% 1/10W: SMT 0603 Ceramic Resistor; Power: 1/10W; Tolerance: 1%; Value: 100K; Supplier 1: Digi-Key; Supplier Part Number 1: 311-100KHRCT-ND
R20 = RES0603 43 1% 1/10W: SMT 0603 Ceramic Resistor; Power: 1/10W; Tolerance: 1%; Value: 43; Supplier 1: Digi-Key; Supplier Part Number 1: 311-43.0HRCT-ND; Supplier 2: Digi-Key; Supplier Part Number 2: P43.0HCT-ND
R21 = RES0603 91 1% 1/10W: SMT 0603 Ceramic Resistor; Power: 1/10W; Tolerance: 1%; Value: 91; Supplier 1: Digi-Key; Supplier 2: Digi-Key; Supplier 3: Digi-Key; Supplier Part Number 1: 311-91.0HRCT-ND; Supplier Part Number 2: 541-91.0HCT-ND; Supplier Part Number 3: RHM91CFCT-ND
R22 = RES0603 13.3K 1% 1/10W: SMT 0603 Ceramic Resistor; Power: 1/10W; Tolerance: 1%; Value: 13.3K; Supplier 1: Digi-Key; Supplier 2: Digi-Key; Supplier Part Number 1: 311-13.3KHRCT-ND; Supplier Part Number 2: P13.3KHCT-ND
R23 R24 = RES0603 28K 0.1% 1/10W: SMT 0603 Ceramic Resistor; Power: 1/10W; Tolerance: 0.1%; Value: 28K; Supplier 1: Digi-Key; Supplier 2: Digi-Key; Supplier Part Number 1: YAG4680CT-ND; Supplier Part Number 2: P28KDBCT-ND
R40 R41 = RES0603 10 1% 1/10W: as R28 on sheet GPS; Value: 10; Supplier 1: Digi-Key; Supplier 2: Digi-Key; Supplier 3: Digi-Key; Supplier Part Number 1: 311-10.0HRCT-ND; Supplier Part Number 2: RMCF0603FT10R0CT-ND; Supplier Part Number 3: CR0603-FX-10R0ELFCT-ND
R42 = RES0603 2.43K 1% 1/10W: SMT 0603 Ceramic Resistor; Power: 1/10W; Tolerance: 1%; Value: 2.43K; Supplier 1: Digi-Key; Supplier 2: Mouser; Supplier Part Number 1: 311-2.43KHRDKR-ND; Supplier Part Number 2: 603-RC0603FR-072K43L
R43 = RES0603 4.32K 1% 1/10W: SMT 0603 Ceramic Resistor; Power: 1/10W; Tolerance: 1%; Value: 4.32K; Supplier 1: Digi-Key; Supplier 2: Digi-Key; Supplier 3: Digi-Key; Supplier Part Number 1: 311-4.32KHRTR-ND; Supplier Part Number 2: P4.32KHCT-ND; Supplier Part Number 3: CRCW06034K32FKEB-ND
R44 R46 = RES0603 10K 1% 1/10W: as R1 on sheet Main; Supplier 1: Digi-Key; Supplier 2: Digi-Key; Supplier 3: Digi-Key; Supplier Part Number 1: 311-10.0KHRCT-ND; Supplier Part Number 2: RMCF0603FT10K0CT-ND; Supplier Part Number 3: P10.0KHCT-ND; Value: 10K
R45 R47 = RC0603FR-07249RL: RES SMD 249 OHM 1% 1/10W 0603; Manufacturer: Yageo; Power Rating: 100mW; Voltage Rating: 50V; Temperature Coefficient: 100ppm/°C; Supplier 1: Digi-Key; Manufacturer Part Number: RC0603FR-07249RL; Stock 1: 517619; Pricing 1: 1=0.1, 10=0.015, 100=0.006, 1000=0.00268, 2500=0.00233 (USD); Case/Package: 0603; Case Code (Imperial): 0603; Case Code (Metric): 1608; Min Operating Temperature: -55°C; Max Operating Temperature: 155°C; Resistance: 249R; Tolerance: 1%; Packaging: Tape and Reel; Package Quantity: 1; Termination: SMD/SMT; Composition: Thick Film; Number of Terminations: 2; Max Power Dissipation: 100mW; Voltage Rating (DC): 50V; Military Standard: Not; Length: 0.063inch; Height: 0.022inch; Width: 0.031inch; Depth: 0.8mm; Lead Free: Lead Free; ComponentLink1URL: https://datasheet.ciiva.com/2454/pyu-r-int-thick-7-2454858.pdf; ComponentLink1Description: https://datasheet.ciiva.com/2454/pyu-r-int-thick-7-2454858.pdf; ComponentLink2URL: https://datasheet.ciiva.com/2454/pyu-r-int-thick-7-2454859.pdf; ComponentLink2Description: https://datasheet.ciiva.com/2454/pyu-r-int-thick-7-2454859.pdf; ComponentLink3URL: https://datasheet.ciiva.com/2454/pyu-r-int-thick-7-2454860.pdf; ComponentLink3Description: https://datasheet.ciiva.com/2454/pyu-r-int-thick-7-2454860.pdf; Supplier Part Number 1: 311-249HRDKR-ND
U5 = AP2114H-3.3TRG1: AP2114 3.3V Fixed LDO Regulator; Supplier 1: Digi-Key; Supplier Part Number 1: AP2114H-3.3TRG1DICT-ND
U6 = LM324DR2G: ON Semi LM324DR2G 1MHz Quad OP-Amp; Supplier 1: Digi-Key; Supplier Part Number 1: LM324DR2GOSCT-ND
U11 = LT1818IS8#PBF: IC OPAMP VFB 400MHZ 8SO; Manufacturer: Linear Technology; Unity Gain Bandwidth Product: 360MHz; Common Mode Rejection Ratio: 73dB; Min Dual Supply Voltage: 1.75V; Max Dual Supply Voltage: 6.3V; Slew Rate: 2500V/µs; Max Supply Voltage: 12.6V; Min Supply Voltage: 3.5V; Number of Circuits: 1; Input Bias Current: 2uA; Input Offset Voltage (Vos): 1.5mV; Operating Supply Current: 9mA; Output Current per Channel: 70mA; Voltage Gain: 72.04dB; Power Supply Rejection Ratio (PSRR): 78dB; Supplier 1: Digi-Key; Manufacturer Part Number: LT1818IS8#PBF; Stock 1: 576; Pricing 1: 1=2.36, 25=1.6728, 100=1.377 (USD); Case/Package: SOIC; Number of Pins: 8; Min Operating Temperature: -40°C; Max Operating Temperature: 85°C; Package Quantity: 100; Packaging: Rail/Tube; Nominal Gain Bandwidth Product: 400MHz; Gain Bandwidth Product: 400MHz; Number of Elements: 1; Number of Channels: 1; Lead Free: Lead Free; ComponentLink1URL: https://datasheet.ciiva.com/1805/1191-1805828.pdf; ComponentLink1Description: https://datasheet.ciiva.com/1805/1191-1805828.pdf; Supplier Part Number 1: LT1818IS8#PBF-ND

## Sheet Accessories.SchDoc: Accessories
size B; Author: Craig Hesling; DrawnBy: Craig Hesling & Anh Luong; Revision: 1.3
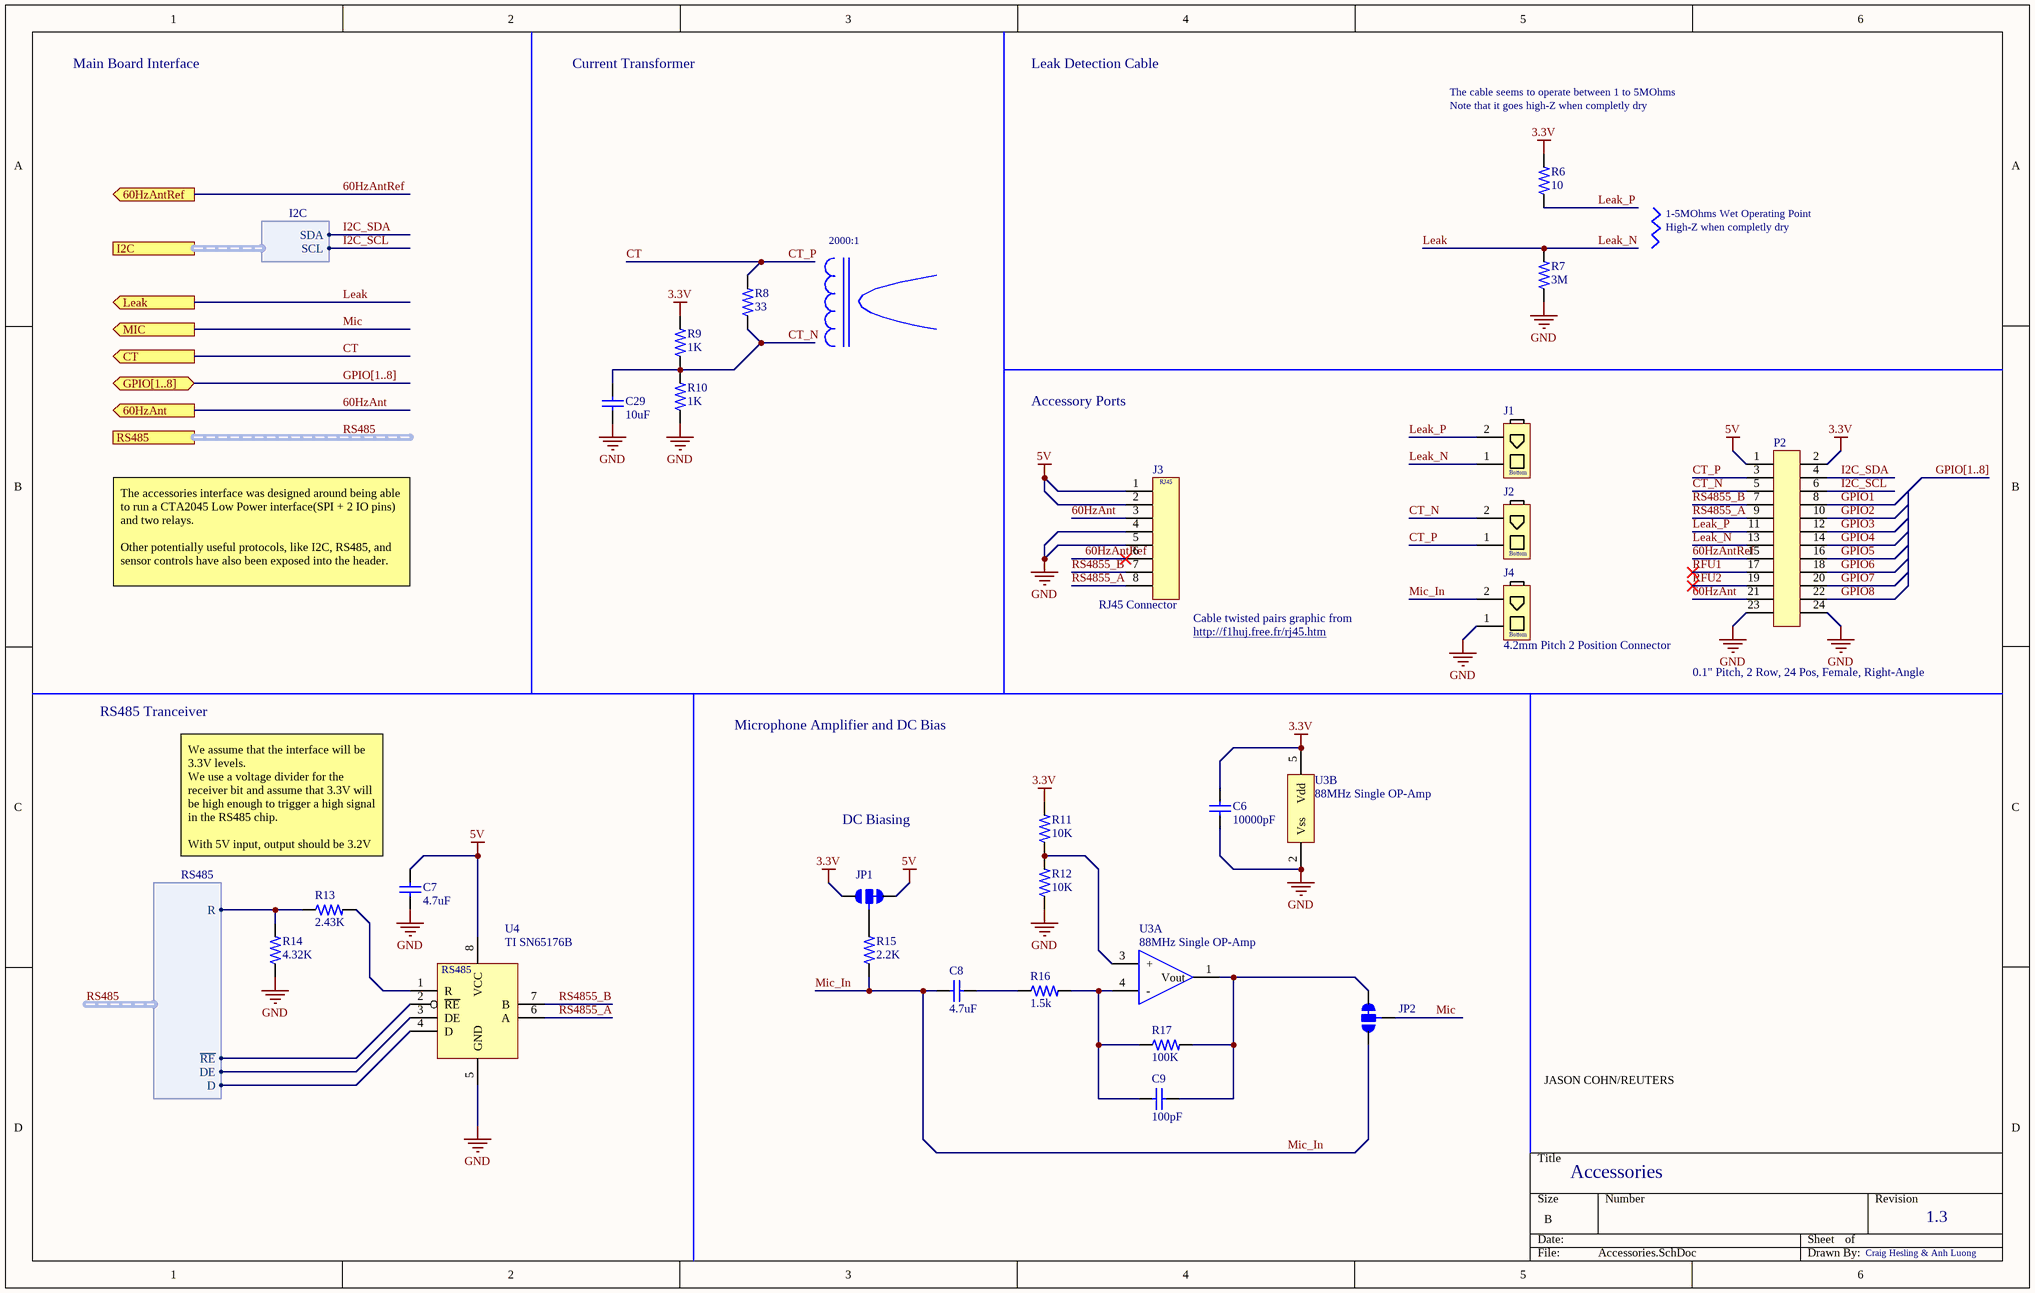
[diagram p4: Accessories.SchDoc]

### Parts
C6  10000pF  [CAPC1608X09L - CAP0603]
C7  4.7uF  [CAPC1608X09L - CAP0603]
C8  4.7uF  [CAPC1608X09L - CAP0603]
C9  100pF  [CAPC1608X09L - CAP0603]
C29  10uF  [CAPC1608X09L - CAP0603]
J1  4.2mm Pitch 2 Position Connector  [2POS 4.2MM PITCH RIGHT ANGLE]  (value not drawn)
J2  4.2mm Pitch 2 Position Connector  [2POS 4.2MM PITCH RIGHT ANGLE]  (value not drawn)
J3  RJ45 Connector  [RJ45 Unshielded PTH Connector]
J4  4.2mm Pitch 2 Position Connector  [2POS 4.2MM PITCH RIGHT ANGLE]
JP1  JUMPER-PAD-3-2OF3_NC_BY_TRACE_SMALL  [PAD-JUMPER-3-2OF3_NC_BY_TRACE_YES_SILK_FULL_BOX]  (value not drawn)
JP2  JUMPER-PAD-3-2OF3_NC_BY_TRACE_SMALL  [PAD-JUMPER-3-2OF3_NC_BY_TRACE_YES_SILK_FULL_BOX]  (value not drawn)
P2  0.1" Pitch, 2 Row, 24 Pos, Female, Right-Angle  [0.1 inch 2 row 24 pos female right-angle header Sullins]
R6  10  [RESC1608X06L - RES0603]
R7  3M  [RESC1608X06L - RES0603]
R8  33  [RESC1608X06L - RES0603]
R9  1K  [RESC1608X06L - RES0603]
R10  1K  [RESC1608X06L - RES0603]
R11  10K  [RESC1608X06L - RES0603]
R12  10K  [RESC1608X06L - RES0603]
R13  2.43K  [RESC1608X06L - RES0603]
R14  4.32K  [RESC1608X06L - RES0603]
R15  2.2K  [RESC1608X06L - RES0603]
R16  1.5k  [RESC1608X06L - RES0603]
R17  100K  [RESC1608X06L - RES0603]
U3  88MHz Single OP-Amp  [SOT95P280X145-5L]  (parts A,B of 2)
U4  TI SN65176B  [SOIC127P600X175-8L]

### Ports
60HzAnt (out), 60HzAntRef (out), CT (out), GPIO[1..8] (bidir), I2C (harness I2C), Leak (out), MIC (out), RS485 (harness RS485)

### Harnesses
I2C: SDA, SCL
RS485: R, ~{RE}, DE, D

### Nets
3.3V: C6.2 JP1.1 P2.2 R6.2 R9.2 R11.2 U3.5(Vdd)
5V: C7.2 J3.1 J3.2 JP1.3 P2.1 U4.8(VCC)
GND: C6.1 C7.1 C29.1 J3.4 J3.5 J4.1(Bottom) P2.23 P2.24 R7.1 R10.1 R12.1 R14.1 U3.2(Vss) U4.5(GND)
60HzAnt: J3.3 P2.21 ; port 60HzAnt
60HzAntRef: J3.6 P2.15 ; port 60HzAntRef
CT: J2.1(Bottom) P2.3 R8.2 ; port CT  [also labelled CT_P]
CT_N: C29.2 J2.2(Top) P2.5 R8.1 R9.1 R10.2
GPIO1: P2.8
GPIO2: P2.10
GPIO3: P2.12
GPIO4: P2.14
GPIO5: P2.16
GPIO6: P2.18
GPIO7: P2.20
GPIO8: P2.22
I2C_SCL: P2.6 ; port I2C.SCL  [project net I2C.SCL]
I2C_SDA: P2.4 ; port I2C.SDA  [project net I2C.SDA]
Leak: J1.1(Bottom) P2.13 R7.2 ; port Leak  [also labelled Leak_N]
Leak_P: J1.2(Top) P2.11 R6.1
Mic: JP2.2 ; port MIC
Mic_In: C8.1 J4.2(Top) JP2.1 R15.1
RFU1: P2.17
RFU2: P2.19
RS485.D: U4.4(D) ; port RS485.D
RS485.DE: U4.2(~{RE}) U4.3(DE) ; port RS485.~{RE}, port RS485.DE
RS485.R: R13.1 R14.2 ; port RS485.R
RS4855_A: J3.8 P2.9 U4.6(A)
RS4855_B: J3.7 P2.7 U4.7(B)
NetC8_2: C8.2 R16.1
NetC9_1: C9.1 R16.2 R17.1 U3.4(-)
NetC9_2: C9.2 JP2.3 R17.2 U3.1(Vout)
NetJP1_2: JP1.2 R15.2
NetR11_1: R11.1 R12.2 U3.3(+)
NetR13_2: R13.2 U4.1(R)

### Buses and harness runs
bus GPIO[1..8]
bus GPIO[1..8] = port GPIO[1..8]
harness RS485 = port RS485

### Notes on the sheet
- Main Board Interface
- Current Transformer
- Leak Detection Cable
- The cable seems to operate between 1 to 5MOhms
- Note that it goes high-Z when completly dry
- 1-5MOhms Wet Operating Point
- High-Z when completly dry
- 2000:1
- Accessory Ports
- The accessories interface was designed around being able to run a CTA2045 Low Power interface(SPI + 2 IO pins) and two relays.
  Other potentially useful protocols, like I2C, RS485, and sensor controls have also been exposed into the header.
- http://f1huj.free.fr/rj45.htm
- (near J3) Cable twisted pairs graphic from
- RS485 Tranceiver
- Microphone Amplifier and DC Bias
- DC Biasing
- We assume that the interface will be 3.3V levels.
  We use a voltage divider for the receiver bit and assume that 3.3V will be high enough to trigger a high signal in the RS485 chip.
  With 5V input, output should be 3.2V at 0A
- JASON COHN/REUTERS
- (in symbol SN65176B) RS485
- (in symbol RJ45 Unshielded PTH Connector) RJ45

### Library data of the parts
C6 = CAP0603 10000pF 10% 50V X7R: as C5 on sheet Main; Value: 10000pF; Supplier 1: Digi-Key; Supplier 2: Digi-Key; Supplier 3: Digi-Key; Supplier Part Number 1: 478-1215-1-ND; Supplier Part Number 2: 311-1080-1-ND; Supplier Part Number 3: 490-1494-1-ND
C7 C8 = CAP0603 4.7uF 10% 6.3V X7R: SMT 0603 Ceramic Capacitor; TempCoeff: X7R; Tolerance: 10%; Voltage: 6.3V; Value: 4.7uF; Supplier 1: Digi-Key; Supplier Part Number 1: 1276-2087-1-ND
C9 = CAP0603 100pF 5% 50V NP0: as C16 on sheet UART; Value: 100pF; Supplier 1: Digi-Key; Supplier 2: Digi-Key; Supplier Part Number 1: 399-1061-1-ND; Supplier Part Number 2: 490-1427-1-ND
C29 = CAP0603 10uF 20% 6.3V X5R: as C12 on sheet Power; Value: 10uF; Supplier 1: Digi-Key; Supplier 2: Digi-Key; Supplier Part Number 1: 587-1256-1-ND; Supplier Part Number 2: 490-3896-1-ND
J1 J2 J4 = 2POS 4.2mm Pitch Right Angle: TE 1586043-2 - 2position 4.2mm pitch right angle with screw support; Positions: 2; Supplier 1: Digi-Key; Supplier Part Number 1: A30626-ND
J3 = RJ45 Unshielded PTH Connector: Amphenol RJ45 Unshielded Through-Hole Connector; Manufacturer: Amphenol FCI; Manufacturer Part Number: 54601-908WPLF; Contact Resistance: 30mR; Current Rating: 1A; Voltage Rating: 1kV; Number of Positions: 8; Number of Ports: 1; Insulation Resistance: 500MR; Direction: Down; Gender: Male; Pitch: 2.54mm; Supplier 1: Digi-Key; Supplier Part Number 1: 609-5081-ND; Supplier 2: Mouser; Stock 2: 0; Pricing 2: 1=0.51, 10=0.377, 50=0.377, 100=0.362, 1000=0.26, 10000=0.212 (USD); Mount: Through Hole; Contact Plating: Nickel,Gold; Contact Material: Bronze,Copper; Colour: Black; Housing Colour: Black; Housing Material: Polyamide; Min Operating Temperature: -65°C; Max Operating Temperature: 125°C; Termination: Through Hole; Orientation: Right Angle; Packaging: Rail/Tube; Shielding: Unshielded; Package Quantity: 200; Number of Rows: 1; Connector Type: RJ45; Number of Contacts: 8; Number of Positions Loaded: 8; Length: 15.24mm; Depth: 18mm; Radiation Hardening: No; REACH SVHC: No SVHC; Lead Free: Lead Free; Flammability Rating: UL94 V-0; ComponentLink1URL: https://datasheet.ciiva.com/9396/c-bmj-0051-9396388.pdf; ComponentLink1Description: https://datasheet.ciiva.com/9396/c-bmj-0051-9396388.pdf; ComponentLink2URL: https://datasheet.ciiva.com/26824/getdatasheetpartid-465238-26824373.pdf; ComponentLink2Description: https://datasheet.ciiva.com/26824/getdatasheetpartid-465238-26824373.pdf; ComponentLink3URL: https://datasheet.ciiva.com/1108/c-bmj-0051-1108424.pdf; ComponentLink3Description: https://datasheet.ciiva.com/1108/c-bmj-0051-1108424.pdf; ComponentLink4URL: https://datasheet.ciiva.com/15058/c-bmj-0051-15058750.pdf; ComponentLink4Description: https://datasheet.ciiva.com/15058/c-bmj-0051-15058750.pdf; ComponentLink5URL: https://datasheet.ciiva.com/16650/c-bmj-0051-16650286.pdf; ComponentLink5Description: https://datasheet.ciiva.com/16650/c-bmj-0051-16650286.pdf; ComponentLink6URL: https://datasheet.ciiva.com/7629/c-bmj-0051-7629183.pdf; ComponentLink6Description: https://datasheet.ciiva.com/7629/c-bmj-0051-7629183.pdf; Supplier Part Number 2: 649-54601-908WPLF
P2 = 0.1" 2 row 24 position female right-angle header sullins: Sullins 0.1" 2 row 24 position female right-angle header; Rows: 2; Positions: 24; Pitch: 2.54mm; Supplier 1: Digi-Key; Supplier 2: Digi-Key; Supplier Part Number 1: S5526-ND; Supplier Part Number 2: S5565-ND
R6 = RES0603 10 1% 1/10W: as R28 on sheet GPS; Value: 10; Supplier 1: Digi-Key; Supplier 2: Digi-Key; Supplier 3: Digi-Key; Supplier Part Number 1: 311-10.0HRCT-ND; Supplier Part Number 2: RMCF0603FT10R0CT-ND; Supplier Part Number 3: CR0603-FX-10R0ELFCT-ND
R7 = RES0603 3M 1% 1/10W: SMT 0603 Ceramic Resistor; Tolerance: 1%; Power: 1/10W; Value: 3M; Supplier 1: Digi-Key; Supplier 2: Digi-Key; Supplier 3: Digi-Key; Supplier Part Number 1: 541-3.00MHCT-ND; Supplier Part Number 2: RMCF0603FT3M00CT-ND; Supplier Part Number 3: 1276-4958-1-ND
R8 = RES0603 33 1% 1/10W: SMT 0603 Ceramic Resistor; Power: 1/10W; Tolerance: 1%; Value: 33; Supplier 1: Digi-Key; Supplier 2: Digi-Key; Supplier 3: Digi-Key; Supplier Part Number 1: 311-33.0HRCT-ND; Supplier Part Number 2: RMCF0603FT33R0CT-ND; Supplier Part Number 3: P33.0HCT-ND
R9 R10 = RES0603 1K 1% 1/10W: as R27 on sheet GPS; Value: 1K; Supplier 1: Digi-Key; Supplier 2: Digi-Key; Supplier 3: Digi-Key; Supplier Part Number 1: 311-1.00KHRCT-ND; Supplier Part Number 2: P1.00KHCT-ND; Supplier Part Number 3: RMCF0603FG1K00CT-ND
R11 R12 = RES0603 10K 1% 1/10W: as R1 on sheet Main; Supplier 1: Digi-Key; Supplier 2: Digi-Key; Supplier 3: Digi-Key; Supplier Part Number 1: 311-10.0KHRCT-ND; Supplier Part Number 2: RMCF0603FT10K0CT-ND; Supplier Part Number 3: P10.0KHCT-ND; Value: 10K
R13 = RES0603 2.43K 1% 1/10W: as R42 on sheet Power; Value: 2.43K; Supplier 1: Digi-Key; Supplier 2: Mouser; Supplier Part Number 1: 311-2.43KHRDKR-ND; Supplier Part Number 2: 603-RC0603FR-072K43L
R14 = RES0603 4.32K 1% 1/10W: as R43 on sheet Power; Value: 4.32K; Supplier 1: Digi-Key; Supplier 2: Digi-Key; Supplier 3: Digi-Key; Supplier Part Number 1: 311-4.32KHRTR-ND; Supplier Part Number 2: P4.32KHCT-ND; Supplier Part Number 3: CRCW06034K32FKEB-ND
R15 = RES0603 2.2K 1% 1/10W: SMT 0603 Ceramic Resistor; Power: 1/10W; Tolerance: 1%; Value: 2.2K; Supplier 1: Digi-Key; Supplier Part Number 1: 311-2.20KHRCT-ND
R16 = RES0603 1.5K 1% 1/10W: SMT 0603 Ceramic Resistor; Power: 1/10W; Tolerance: 1%; Value: 1.5k; Supplier 1: Digi-Key; Supplier 2: Digi-Key; Supplier Part Number 1: 311-1.50KHRCT-ND; Supplier Part Number 2: RMCF0603FT1K50CT-ND
R17 = RES0603 100K 1% 1/10W: as R18 on sheet Power; Value: 100K; Supplier 1: Digi-Key; Supplier Part Number 1: 311-100KHRCT-ND
U3 = LMV793MF/NOPB: TI LMV793MF/NOPB 88MHz Single OP-Amp; Slew Rate: 35 V/us; Bandwidth: 88MHz; Supplier 1: Digi-Key; Supplier Part Number 1: LMV793MF/NOPBCT-ND
U4 = SN65176B: Half Duplex RS485 Tranceiver; Supplier 1: Digi-Key; Supplier 2: Mouser; Supplier Part Number 1: 296-14636-1-ND; Supplier Part Number 2: 595-SN65176BDR

## Sheet UI.SchDoc: User Interface
size A; Author: Craig Hesling; DrawnBy: Craig Hesling; Revision: 1.1
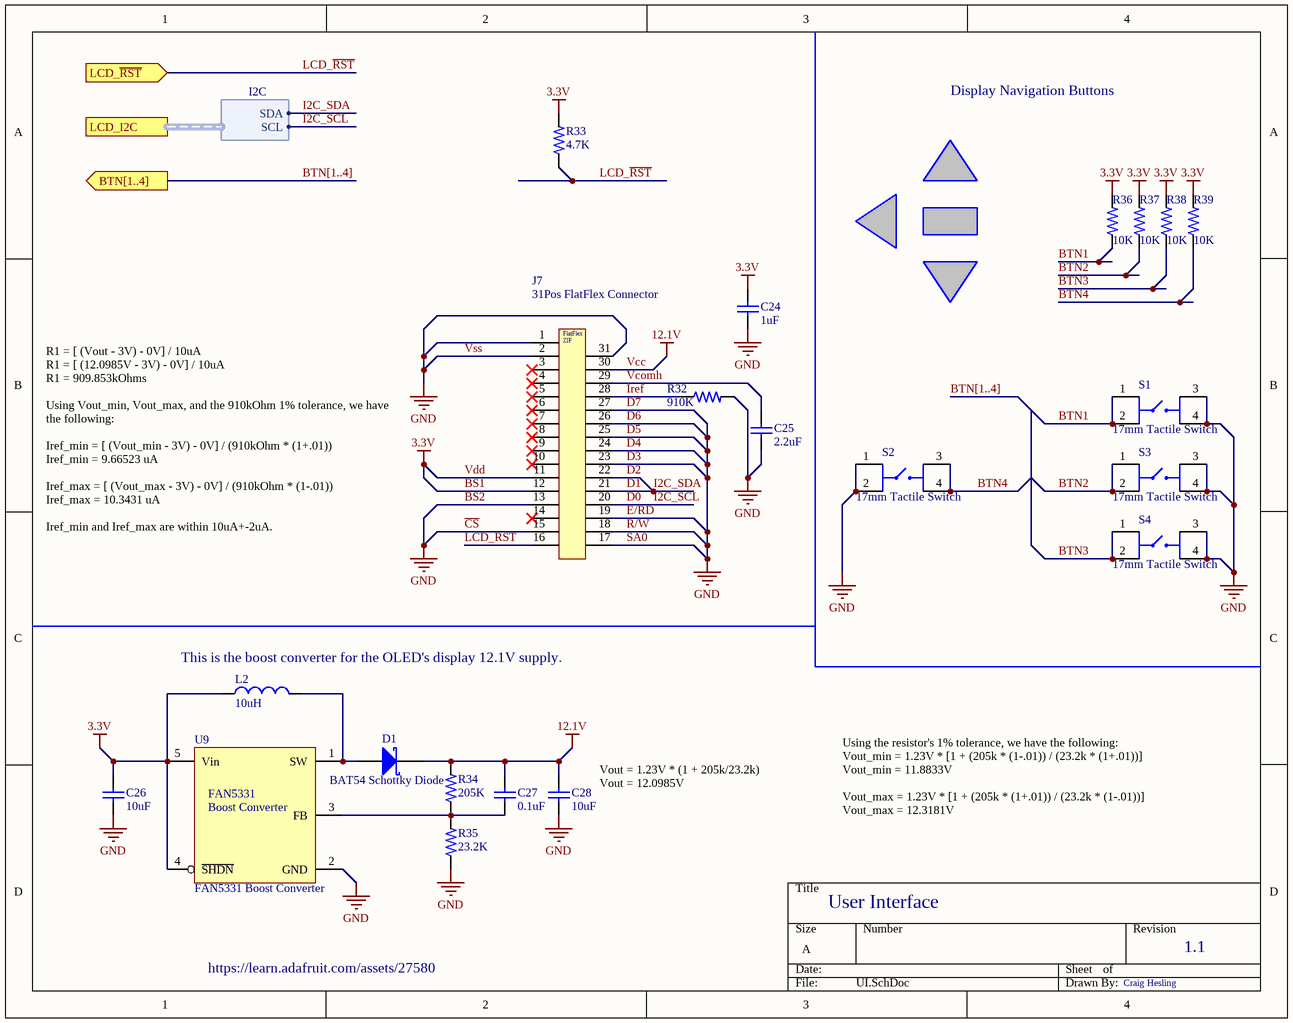
[diagram p5: UI.SchDoc]

### Parts
C24  1uF  [CAPC1608X09L - CAP0603]
C25  2.2uF  [CAPC1608X09L - CAP0603]
C26  10uF  [CAPC2013X14L - CAP0805 1.45mm Tall]
C27  0.1uF  [CAPC1608X09L - CAP0603]
C28  10uF  [CAPC3216X18L - CAP1206 1.8MM TALL]
D1  BAT54 Schottky Diode  [SOT95P240X120-3L - ON Semi]
J7  31Pos FlatFlex Connector  [31 Position Flat Flex ZIF Connector]
L2  10uH  [INDP4949X20L]
R32  910K  [RESC1608X06L - RES0603]
R33  4.7K  [RESC1608X06L - RES0603]
R34  205K  [RESC1608X06L - RES0603]
R35  23.2K  [RESC1608X06L - RES0603]
R36  10K  [RESC1608X06L - RES0603]
R37  10K  [RESC1608X06L - RES0603]
R38  10K  [RESC1608X06L - RES0603]
R39  10K  [RESC1608X06L - RES0603]
S1  17mm Tactile Switch  [TactileSwitchTE17mm]
S2  17mm Tactile Switch  [TactileSwitchTE17mm]
S3  17mm Tactile Switch  [TactileSwitchTE17mm]
S4  17mm Tactile Switch  [TactileSwitchTE17mm]
U9  FAN5331 Boost Converter  [SOT95P280X145-5L - ON Semi]

### Ports
BTN[1..4] (out), LCD_I2C (harness I2C), LCD_~{RST} (in)

### Harnesses
I2C: SDA, SCL

### Nets
3.3V: C24.2 C26.2 J7.11 J7.12 L2.1 R33.2 R36.2 R37.2 R38.2 R39.2 U9.4(~{SHDN}) U9.5(Vin)  [also labelled BS1, Vdd]
GND: C24.1 C25.1 C26.1 C28.1 J7.1 J7.2 J7.13 J7.15 J7.17 J7.18 J7.19 J7.23 J7.24 J7.25 J7.26 J7.27 J7.31 R32.2 R35.1 S1.3 S1.4 S2.1 S2.2 S3.3 S3.4 S4.3 S4.4 U9.2(GND)  [also labelled BS2, ~{CS}, D3, D4, D5, D6, D7, ~{E/RD}, ~{R/W}, SA0, Vss]
Vcc: C27.2 C28.2 D1.3(K) J7.30 R34.2  [also labelled 12.1V]
BTN1: R36.1 S1.1 S1.2
BTN2: R37.1 S3.1 S3.2
BTN3: R38.1 S4.1 S4.2
BTN4: R39.1 S2.3 S2.4
D0: J7.20 ; port LCD_I2C.SCL  [also labelled I2C_SCL]  [project net I2C.SCL]
D1: J7.21 J7.22 ; port LCD_I2C.SDA  [also labelled D2, I2C_SDA]  [project net I2C.SDA]
Iref: J7.28 R32.1
LCD_~{RST}: J7.16 R33.1 ; port LCD_~{RST}
Vcomh: C25.2 J7.29
NetC27_1: C27.1 R34.1 R35.2 U9.3(FB)
NetD1_1: D1.1(A) L2.2 U9.1(SW)

Not connected (* = marked no-connect by the designer): J7 3* 4* 5* 6* 7* 8* 9* 10* 14*

### Buses and harness runs
bus BTN[1..4]
bus BTN[1..4] = port BTN[1..4]

### Notes on the sheet
- Display Navigation Buttons
- R1 = [ (Vout - 3V) - 0V] / 10uA
  R1 = [ (12.0985V - 3V) - 0V] / 10uA
  R1 = 909.853kOhms
  Using Vout_min, Vout_max, and the 910kOhm 1% tolerance, we have the following:
  Iref_min = [ (Vout_min - 3V) - 0V] / (910kOhm * (1+.01))
  Iref_min = 9.66523 uA
  Iref_max = [ (Vout_max - 3V) - 0V] / (910kOhm * (1-.01))
  Iref_max = 10.3431 uA
  Iref_min and Iref_max are within 10uA+-2uA.
- (near L2) This is the boost converter for the OLED's display 12.1V supply.
- (near C28) Vout = 1.23V * (1 + 205k/23.2k)
  Vout = 12.0985V
- Using the resistor's 1% tolerance, we have the following:
  Vout_min = 1.23V * [1 + (205k * (1-.01)) / (23.2k * (1+.01))]
  Vout_min = 11.8833V
  Vout_max = 1.23V * [1 + (205k * (1+.01)) / (23.2k * (1-.01))]
  Vout_max = 12.3181V
- https://learn.adafruit.com/assets/27580
- (in symbol 31 Position Flat Flex ZIF Connector) FlatFlex; ZIF
- (in symbol FAN5331) Boost Converter

### Library data of the parts
C24 = CAP0603 1uF 5% 10V X7R: SMT 0603 Ceramic Capacitor; TempCoeff: X7R; Tolerance: 5%; Voltage: 10V; Value: 1uF; Supplier 1: Digi-Key; Supplier 2: Mouser; Supplier 3: Digi-Key; Supplier Part Number 1: 478-10074-1-ND; Supplier Part Number 2: 581-0603ZC105JAT2A; Supplier Part Number 3: 311-3484-1-ND
C25 = CAP0603 2.2uF 10% 6.3V X7R: SMT 0603 Ceramic Capacitor; TempCoeff: X7R; Tolerance: 10%; Voltage: 6.3V; Value: 2.2uF; Supplier 1: Digi-Key; Supplier 2: Digi-Key; Supplier Part Number 1: 1276-2017-1-ND; Supplier Part Number 2: 311-1795-1-ND
C26 = CAP0805 10uF 10% 6.3V X5R: as C4 on sheet Main; Value: 10uF; Supplier 1: Digi-Key; Supplier Part Number 1: 1276-6457-1-ND
C27 = CAP0603 0.1uF 10% 25V X7R: as C23 on sheet Power; Value: 0.1uF; Supplier 1: Digi-Key; Supplier 2: Digi-Key; Supplier Part Number 1: 311-1341-1-ND; Supplier Part Number 2: 490-1524-1-ND
C28 = CAP1206 10uF 10% 16V X5R: SMT 1206 Ceramic Capacitor; TempCoeff: X5R; Tolerance: 10%; Voltage: 16V; Value: 10uF; Supplier 1: Digi-Key; Supplier 2: Digi-Key; Supplier Part Number 1: 1276-1137-1-ND; Supplier Part Number 2: 490-10526-1-ND
D1 = BAT54: ON Semi BAT54 800mV Schottky Diode; Vr: 30V; Vf: 800mV; Supplier 1: Digi-Key; Supplier 2: Mouser; Supplier Part Number 1: BAT54SLT1GOSCT-ND; Supplier Part Number 2: 512-BAT54
J7 = 31 Position Flat Flex ZIF Connector: TE 3-1734839-1 31 Position Flat Flex ZIF Connector; Positions: 31; Supplier 1: Digi-Key; Supplier Part Number 1: A101346CT-ND
L2 = INDWW 10uH 1.45A 20% 144mOhm 24MHz: SMT Wire Wound Inductor; Tolerance: 20%; Current Rating: 1.45A; Self Resonant: 24MHz; Value: 10uH; DC Resistance: 144mOhm; Supplier 1: Digi-Key; Supplier 2: Mouser; Supplier Part Number 1: 587-2409-1-ND; Supplier Part Number 2: 963-NRS5020T100MMGJ
R32 = RES0603 910K 1% 1/10W: SMT 0603 Ceramic Resistor; Power: 1/10W; Tolerance: 1%; Value: 910K; Supplier 1: Digi-Key; Supplier 2: Digi-Key; Supplier 3: Digi-Key; Supplier Part Number 1: 311-910KHRCT-ND; Supplier Part Number 2: P910KHCT-ND; Supplier Part Number 3: RMCF0603FT910KCT-ND
R33 = RES0603 4.7K 1% 1/10W: as R4 on sheet Main; Value: 4.7K; Supplier 1: Digi-Key; Supplier 2: Digi-Key; Supplier 3: Digi-Key; Supplier Part Number 1: 311-4.70KHRCT-ND; Supplier Part Number 2: P4.70KHCT-ND; Supplier Part Number 3: RMCF0603FT4K70CT-ND
R34 = RES0603 205K 1% 1/10W: SMT 0603 Ceramic Resistor; Power: 1/10W; Tolerance: 1%; Value: 205K; Supplier 1: Digi-Key; Supplier 2: Digi-Key; Supplier 3: Digi-Key; Supplier Part Number 1: 311-205KHRCT-ND; Supplier Part Number 2: P205KHCT-ND; Supplier Part Number 3: 541-205KHCT-ND
R35 = RES0603 23.2K 1% 1/10W: SMT 0603 Ceramic Resistor; Power: 1/10W; Tolerance: 1%; Value: 23.2K; Supplier 1: Digi-Key; Supplier 2: Digi-Key; Supplier 3: Digi-Key; Supplier Part Number 1: 311-23.2KHRCT-ND; Supplier Part Number 2: 541-23.2KHCT-ND; Supplier Part Number 3: RMCF0603FG23K2CT-ND
R36-R39 = RES0603 10K 1% 1/10W: as R1 on sheet Main; Supplier 1: Digi-Key; Supplier 2: Digi-Key; Supplier 3: Digi-Key; Supplier Part Number 1: 311-10.0KHRCT-ND; Supplier Part Number 2: RMCF0603FT10K0CT-ND; Supplier Part Number 3: P10.0KHCT-ND; Value: 10K
S1-S4 = TE 3-1825910-1 17mm Tactile Switch: Supplier 1: Digi-Key; Supplier Part Number 1: 450-1643-ND
U9 = FAN5331: ON Semi FAN5531 Boost Converter; Supplier 1: Digi-Key; Supplier 2: Mouser; Supplier Part Number 1: FAN5331SXCT-ND; Supplier Part Number 2: 512-FAN5331SX

## Sheet LoRa.SchDoc: LoRa
size A; Author: Craig Hesling; DrawnBy: Craig Hesling; Revision: 1
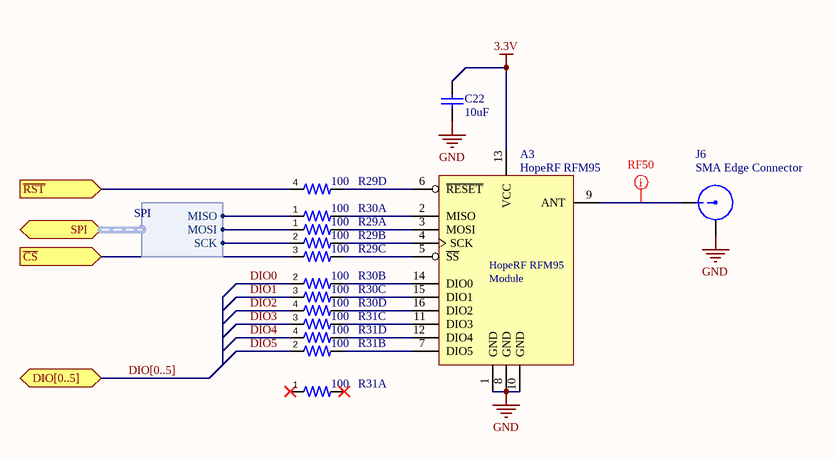
[diagram p6: LoRa.SchDoc]

### Parts
A3  HopeRF RFM95  [RFM95/9697/98W]
C22  10uF  [CAPC2013X14L - CAP0805 1.45mm Tall]
J6  SMA Edge Connector  [SMA Connector - Edge Mount]
R29  100  [CAC-80P319X159-8L]  (parts A,B,C,D of 4)
R30  100  [CAC-80P319X159-8L]  (parts A,B,C,D of 4)
R31  100  [CAC-80P319X159-8L]  (parts A,B,C,D of 4)

### Ports
DIO[0..5] (bidir), SPI (harness SPI), ~{CS} (in), ~{RST} (in)

### Harnesses
SPI: MISO, MOSI, SCK

### Nets
3.3V: A3.13(VCC) C22.2
GND: A3.1(GND) A3.8(GND) A3.10(GND) C22.1 J6.2(GND)
DIO0: R30.2
DIO1: R30.3
DIO2: R30.4
DIO3: R31.3
DIO4: R31.4
DIO5: R31.2
LoRa_~{RST}: R29.4 ; port ~{RST}
SPI.MISO: R30.1 ; port SPI.MISO
SPI.MOSI: R29.1 ; port SPI.MOSI
SPI.SCK: R29.2 ; port SPI.SCK
SPI_~{CS1}: R29.3 ; port ~{CS}
NetA3_2: A3.2(MISO) R30.8
NetA3_3: A3.3(MOSI) R29.8
NetA3_4: A3.4(SCK) R29.7
NetA3_5: A3.5(~{SS}) R29.6
NetA3_6: A3.6(~{RESET}) R29.5
NetA3_7: A3.7(DIO5) R31.7
NetA3_9: A3.9(ANT) J6.1(Signal)
NetA3_11: A3.11(DIO3) R31.6
NetA3_12: A3.12(DIO4) R31.5
NetA3_14: A3.14(DIO0) R30.7
NetA3_15: A3.15(DIO1) R30.6
NetA3_16: A3.16(DIO2) R30.5

Not connected (* = marked no-connect by the designer): R31 1* 8*

### Buses and harness runs
bus DIO[0..5] = port DIO[0..5]

### Layout directives
net class RF50: NetA3_9

### Notes on the sheet
- (in symbol RFM95) Module

### Library data of the parts
A3 = RFM95: HopeRF RFM95 915MHz LoRa Radio; Supplier 1: Digi-Key; Supplier 2: Digi-Key; Supplier Part Number 1: 1597-1488-ND; Supplier Part Number 2: RFM95W-915S2-ND
C22 = CAP0805 10uF 10% 6.3V X5R: as C4 on sheet Main; Value: 10uF; Supplier 1: Digi-Key; Supplier Part Number 1: 1276-6457-1-ND
R29-R31 = RESARR1206 100 5% 1/16W: Tolerance: 5%; Power: 1/16W; Supplier 1: Digi-Key; Supplier Part Number 1: YC164J-100CT-ND; Value: 100
J6 = SMA Edge Connector: Supplier 1: Digi-Key; Supplier 2: Digi-Key; Supplier 3: Digi-Key; Supplier Part Number 1: CON-SMA-EDGE-S-ND; Supplier Part Number 2: 931-1174-ND; Supplier Part Number 3: 931-1175-ND

## Sheet Mechanical.SchDoc: Mechanical Parts
size A; Author: Craig Hesling; DrawnBy: Craig Hesling; Revision: 1
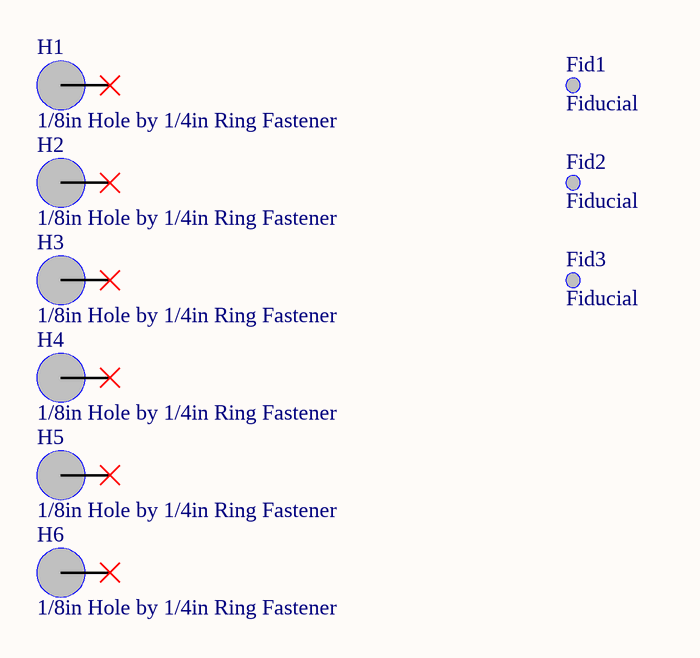
[diagram p7: Mechanical.SchDoc]

### Parts
Fid1  Fiducial  [Fiducial 1mm]
Fid2  Fiducial  [Fiducial 1mm]
Fid3  Fiducial  [Fiducial 1mm]
H1  1/8in Hole by 1/4in Ring Fastener  [1/8in Fastener Hole]
H2  1/8in Hole by 1/4in Ring Fastener  [1/8in Fastener Hole]
H3  1/8in Hole by 1/4in Ring Fastener  [1/8in Fastener Hole]
H4  1/8in Hole by 1/4in Ring Fastener  [1/8in Fastener Hole]
H5  1/8in Hole by 1/4in Ring Fastener  [1/8in Fastener Hole]
H6  1/8in Hole by 1/4in Ring Fastener  [1/8in Fastener Hole]

### Nets

Not connected (* = marked no-connect by the designer): H1 1*; H2 1*; H3 1*; H4 1*; H5 1*; H6 1*

### Library data of the parts
Fid1-Fid3 = Fiducial 1mm: 1mm Fiducial Mark
H1-H6 = 1/8in by 1/4in Fastner Hole

## Nets that join several sheets
3.3V: Main (11 pins), GPS (C20.2 R27.2 U8.22 U8.23), Power (8 pins), Accessories (7 pins), UI (12 pins), LoRa (A3.13 C22.2)
5V: Main (P1.2 P1.4), Power (7 pins), Accessories (6 pins)
GND: Main (24 pins), GPS (10 pins), UART (10 pins), Power (15 pins), Accessories (14 pins), UI (28 pins), LoRa (5 pins)
60Hz: Main (A1.7 P1.22), Power (JP7.2)
60HzAnt: Main (JP5.2), Power (JP6.1 R46.1), Accessories (J3.3 P2.21)
60HzAntRef: Power (R44.2 R45.2 R47.1 U11.2), Accessories (J3.6 P2.15)
BTN1: Main (U1.21), UI (R36.1 S1.1 S1.2)
BTN2: Main (U1.22), UI (R37.1 S3.1 S3.2)
BTN3: Main (U1.23), UI (R38.1 S4.1 S4.2)
BTN4: Main (U1.24 U10.6), UI (R39.1 S2.3 S2.4)
CT: Main (A1.4), Accessories (J2.1 P2.3 R8.2)
DIO0: Main (U1.3), LoRa (R30.2)
DIO1: Main (U1.4), LoRa (R30.3)
DIO2: Main (U1.5), LoRa (R30.4)
DIO3: Main (U1.6), LoRa (R31.3)
DIO4: Main (U1.7), LoRa (R31.4)
DIO5: Main (U1.8), LoRa (R31.2)
GPIO1: Main (A1.14), Accessories (P2.8)
GPIO2: Main (A1.16), Accessories (P2.10)
GPIO3: Main (A1.13), Accessories (P2.12)
GPIO4: Main (A1.23), Accessories (P2.14)
GPIO5: Main (U1.25), Accessories (P2.16)
GPIO6: Main (U1.26), Accessories (P2.18)
GPIO7: Main (U1.27), Accessories (P2.20)
GPIO8: Main (U1.28), Accessories (P2.22)
GPS_PPS: Main (A1.6 P1.32), GPS (U8.3)
I2C.SCL: Main (A1.11 P1.5 R5.1 U1.12), Accessories (P2.6), UI (J7.20)
I2C.SDA: Main (A1.10 P1.3 R4.1 U1.13), Accessories (P2.4), UI (J7.21 J7.22)
IO0: Main (A1.25 P1.16 R1.1 TP1.1), UART (Q1.6)
LCD_~{RST}: Main (U1.1), UI (J7.16 R33.1)
Leak: Main (U10.3), Accessories (J1.1 P2.13 R7.2)
LoRa_~{RST}: Main (U1.2), LoRa (R29.4)
MCU_EN: Main (A1.3 P1.18 R2.1 TP2.1), UART (Q1.3)
MCU_RX: Main (A1.34 P1.8 TP3.1), UART (U7.30)
MCU_TX: Main (A1.35 P1.10 TP4.1), UART (U7.2)
Mic: Main (U10.1), Accessories (JP2.2)
RS485.D: Main (A1.28), Accessories (U4.4)
RS485.DE: Main (A1.36), Accessories (U4.2 U4.3)
RS485.R: Main (A1.27), Accessories (R13.1 R14.2)
SPI.MISO: Main (A1.31), GPS (FB4.1), LoRa (R30.1)
SPI.MOSI: Main (A1.37), GPS (FB5.1), LoRa (R29.1)
SPI.SCK: Main (A1.30), GPS (FB3.1), LoRa (R29.2)
SPI_~{CS0}: Main (A1.29), GPS (FB2.1)
SPI_~{CS1}: Main (A1.33), LoRa (R29.3)